# EasyEDA Pro project QV-601-Contril - 副本.eprj

# Schematic Schematic1

## Sheets
1 P1: Board Name: Schematic2; Create Date: 2025-07-12; Page Name: P1; Project Name: QV-601-Contril - 副本; Schematic Name: Schematic1; Update Date: 2025-07-28; Company: 嘉立创EDA; Page Size: A4; Version: V1.0
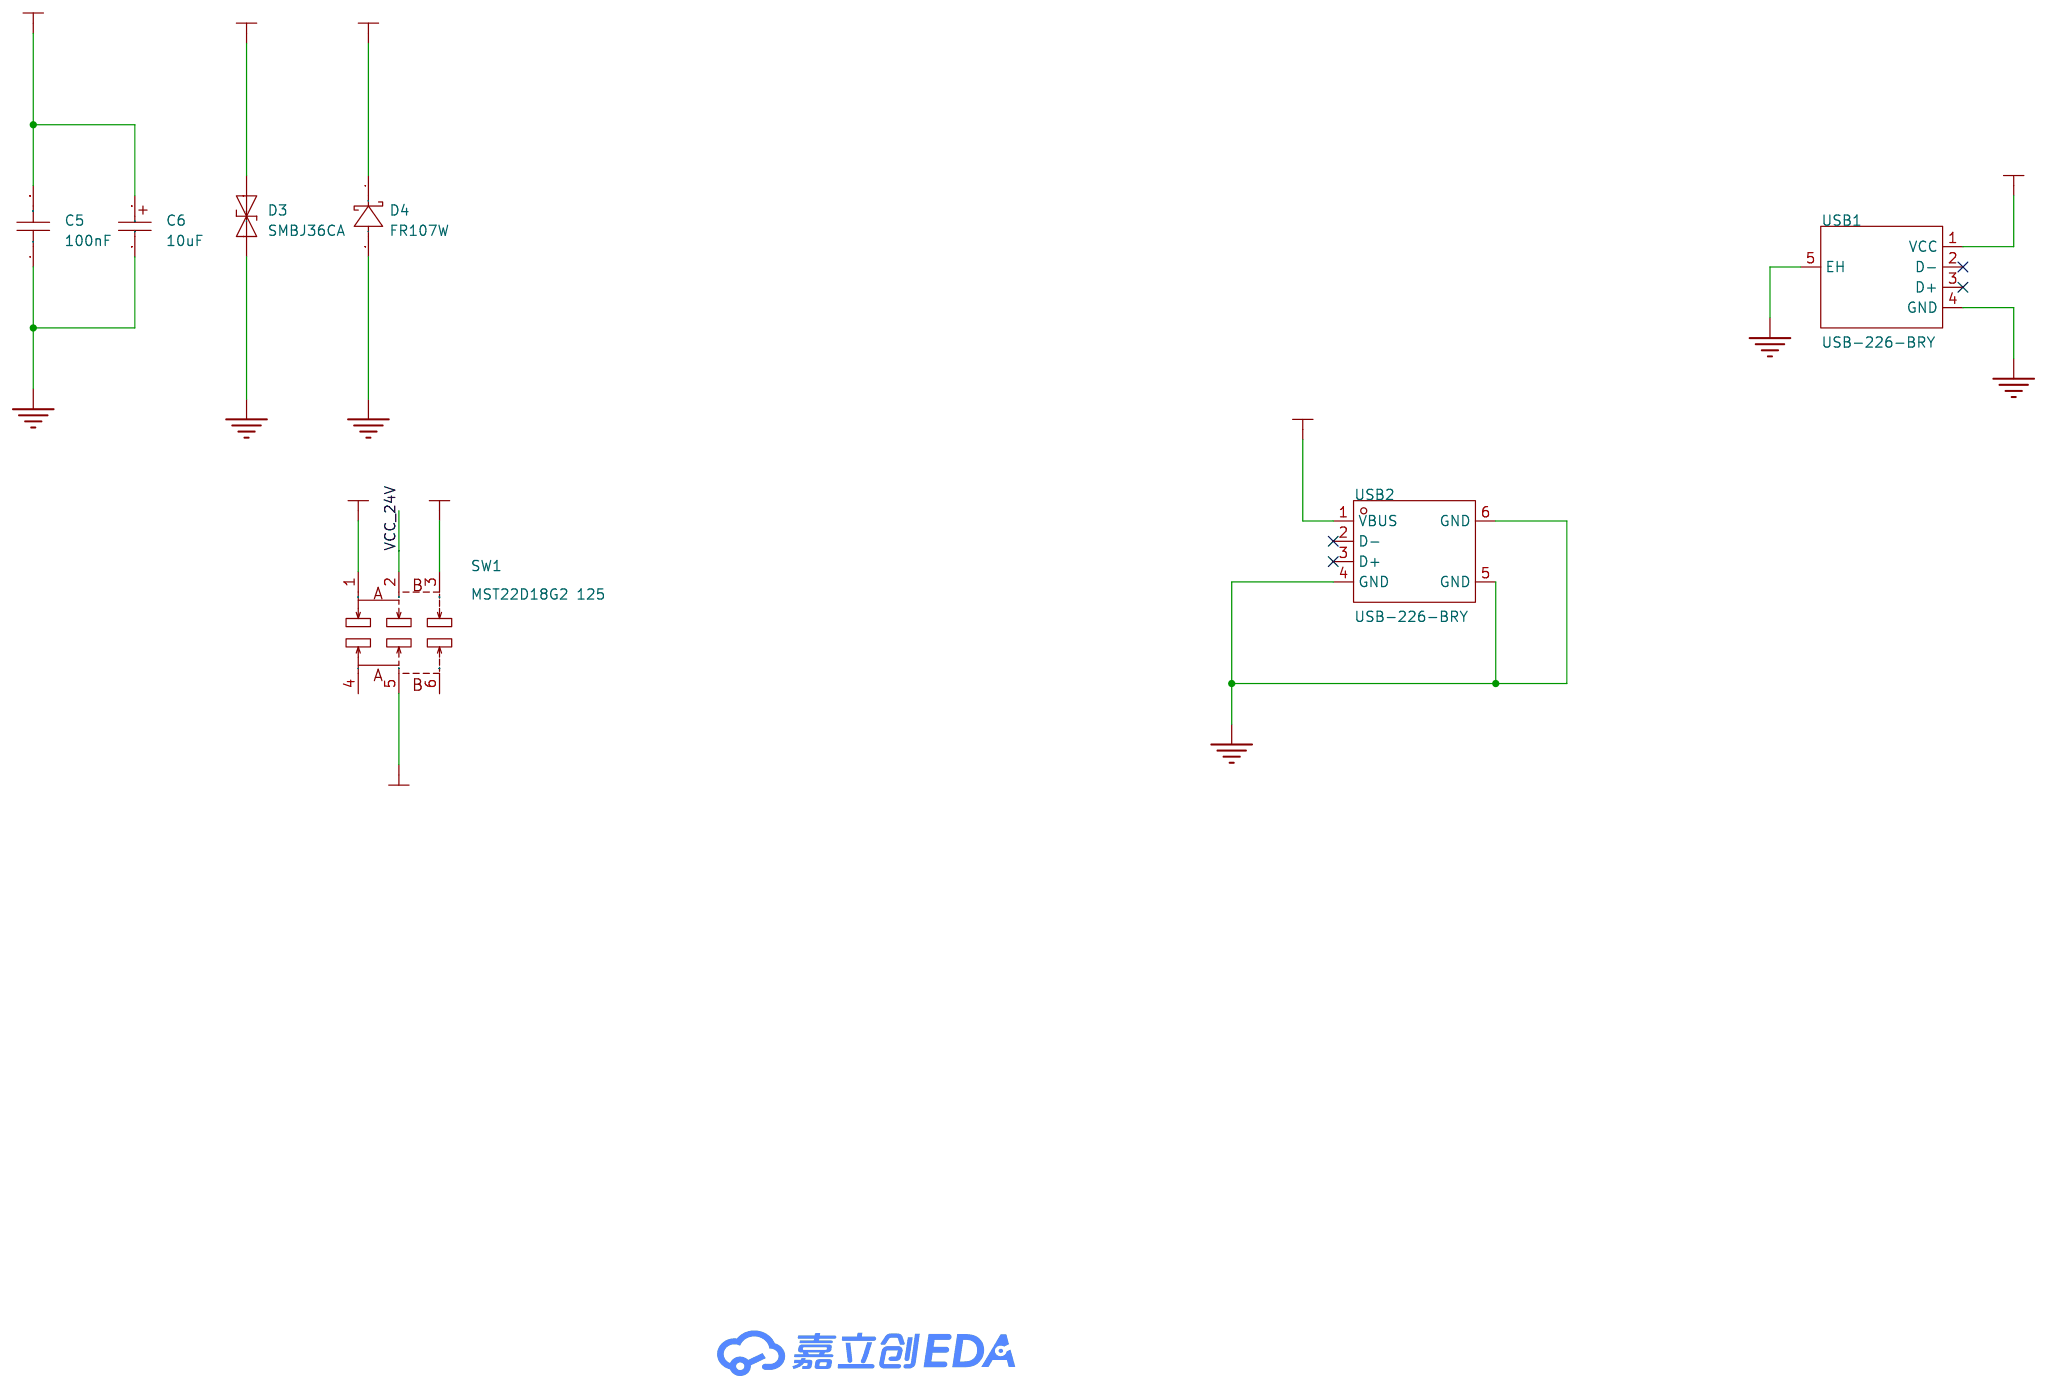
[diagram p0: P1]
2 P2: Create Date: 2025-07-28; Page Name: P2
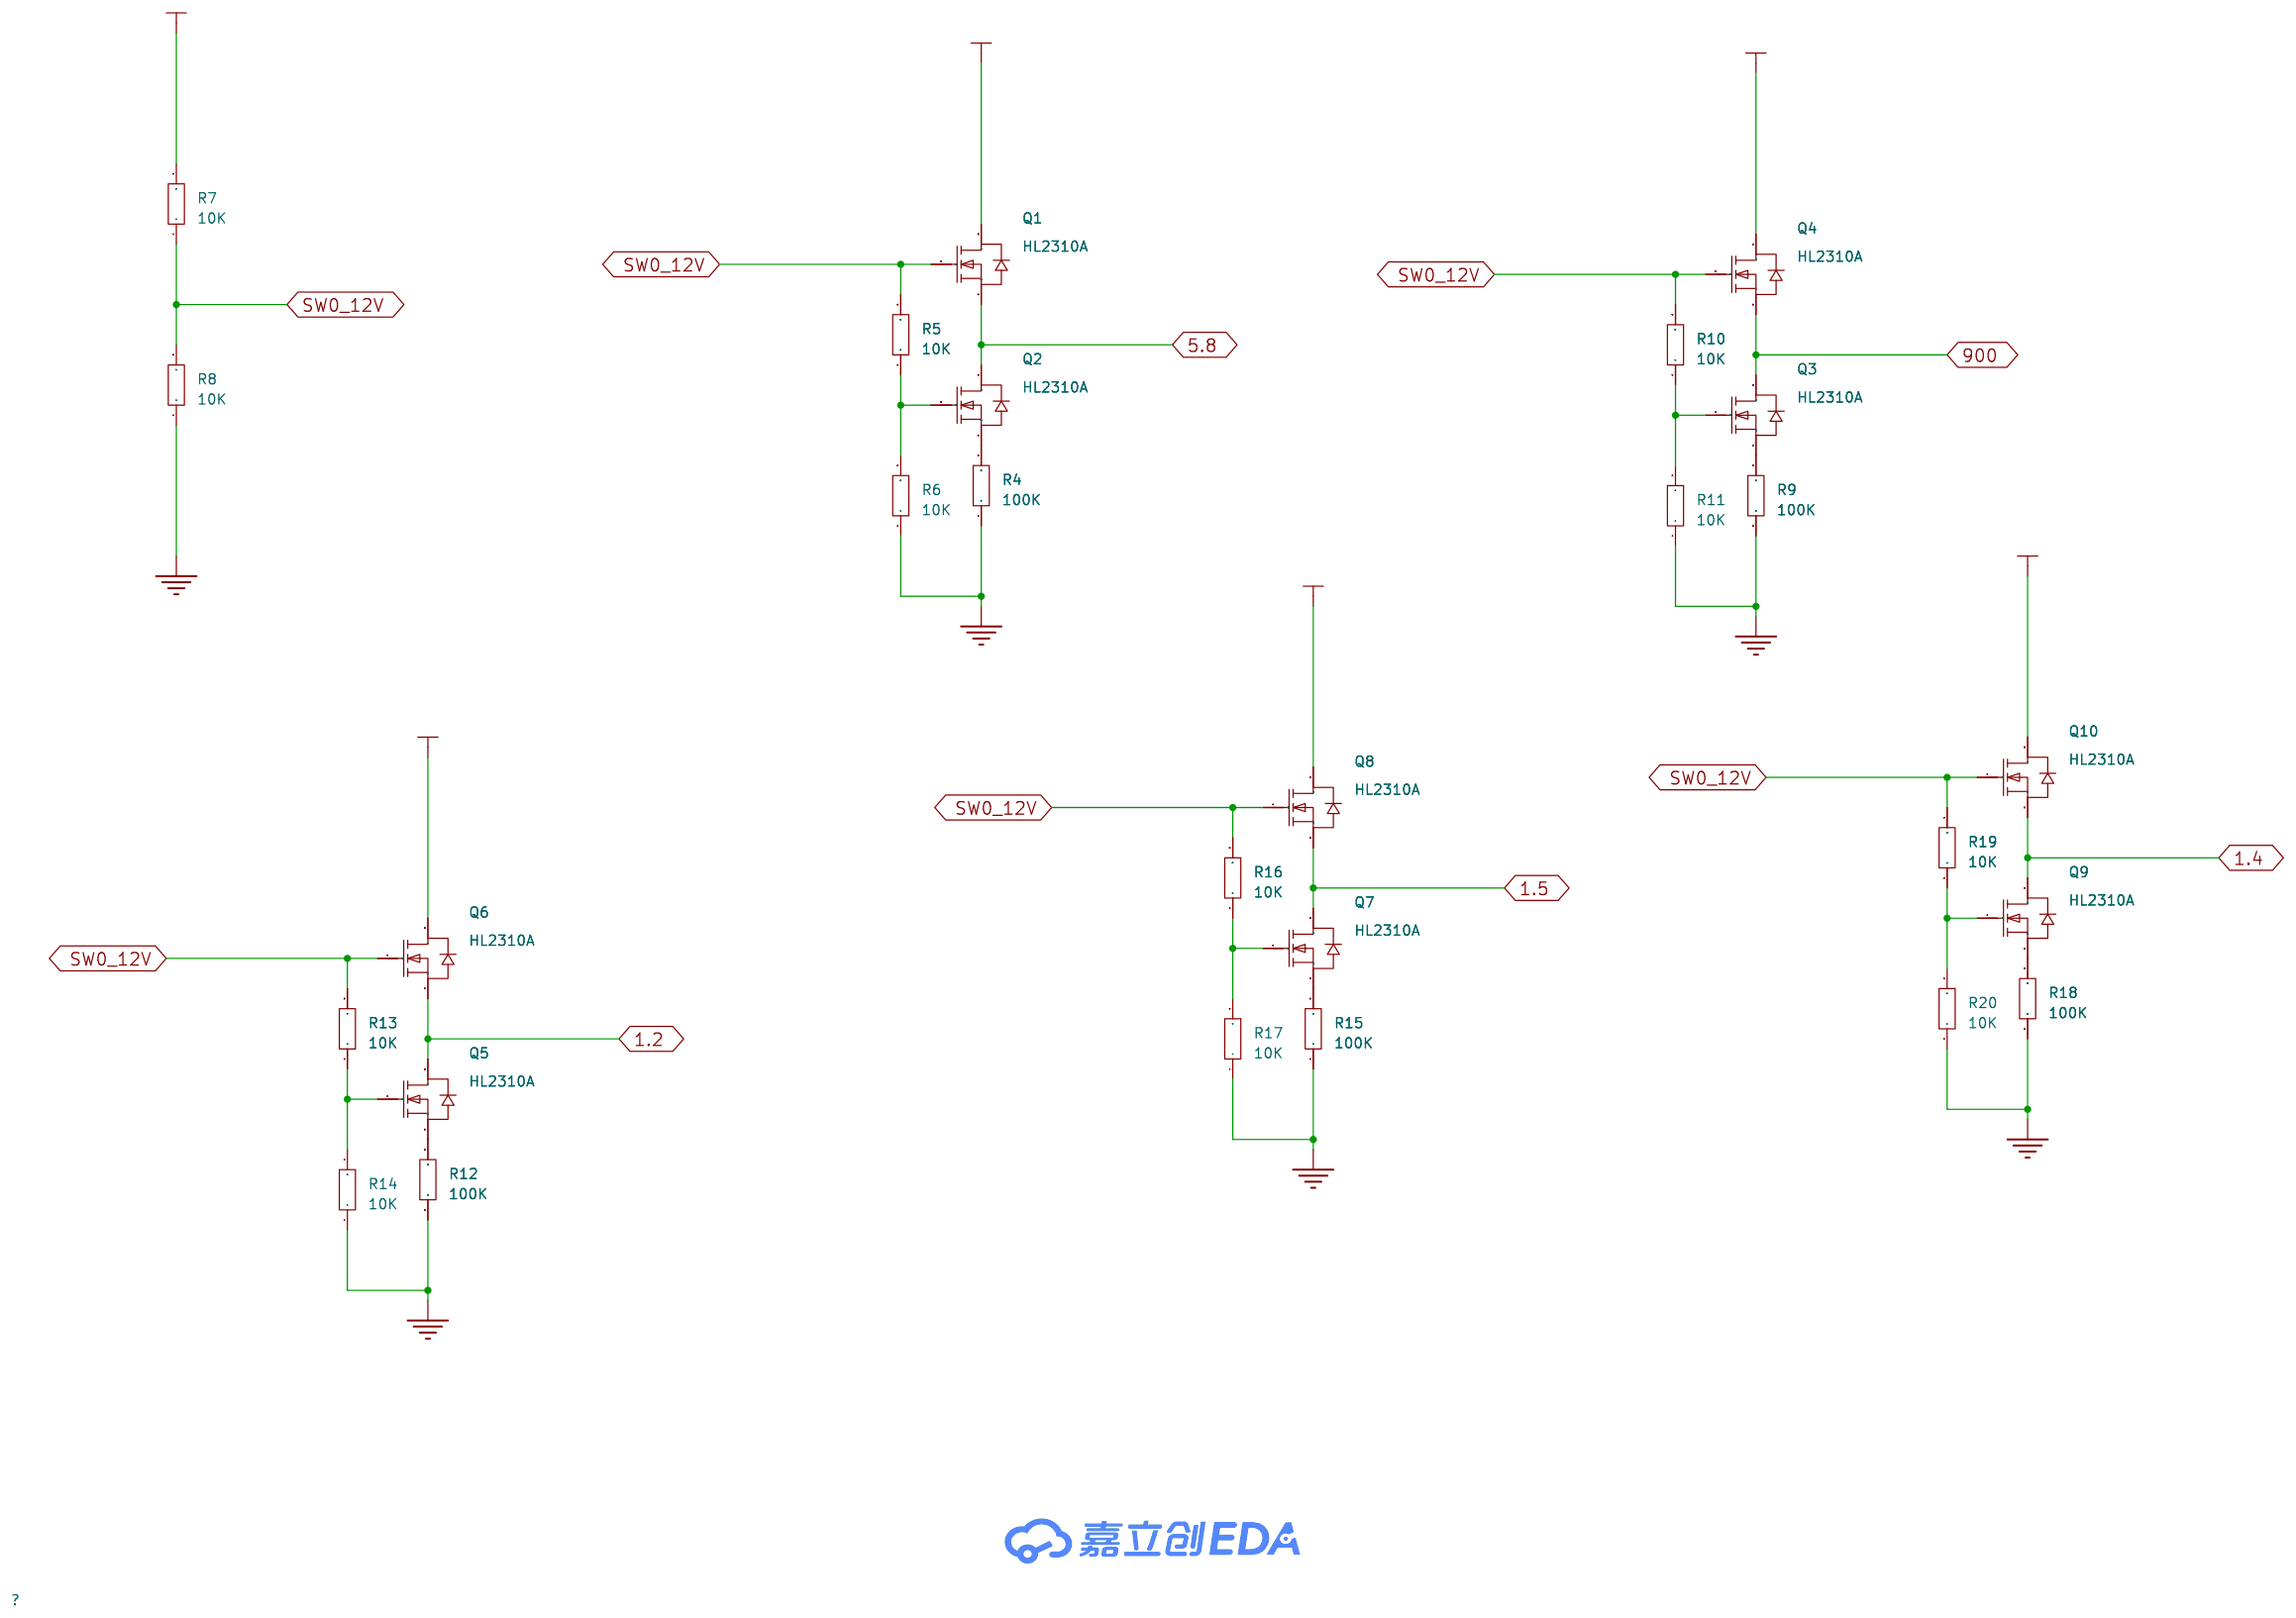
[diagram p1: P2]
3 P3: Create Date: 2025-07-28; Page Name: P3
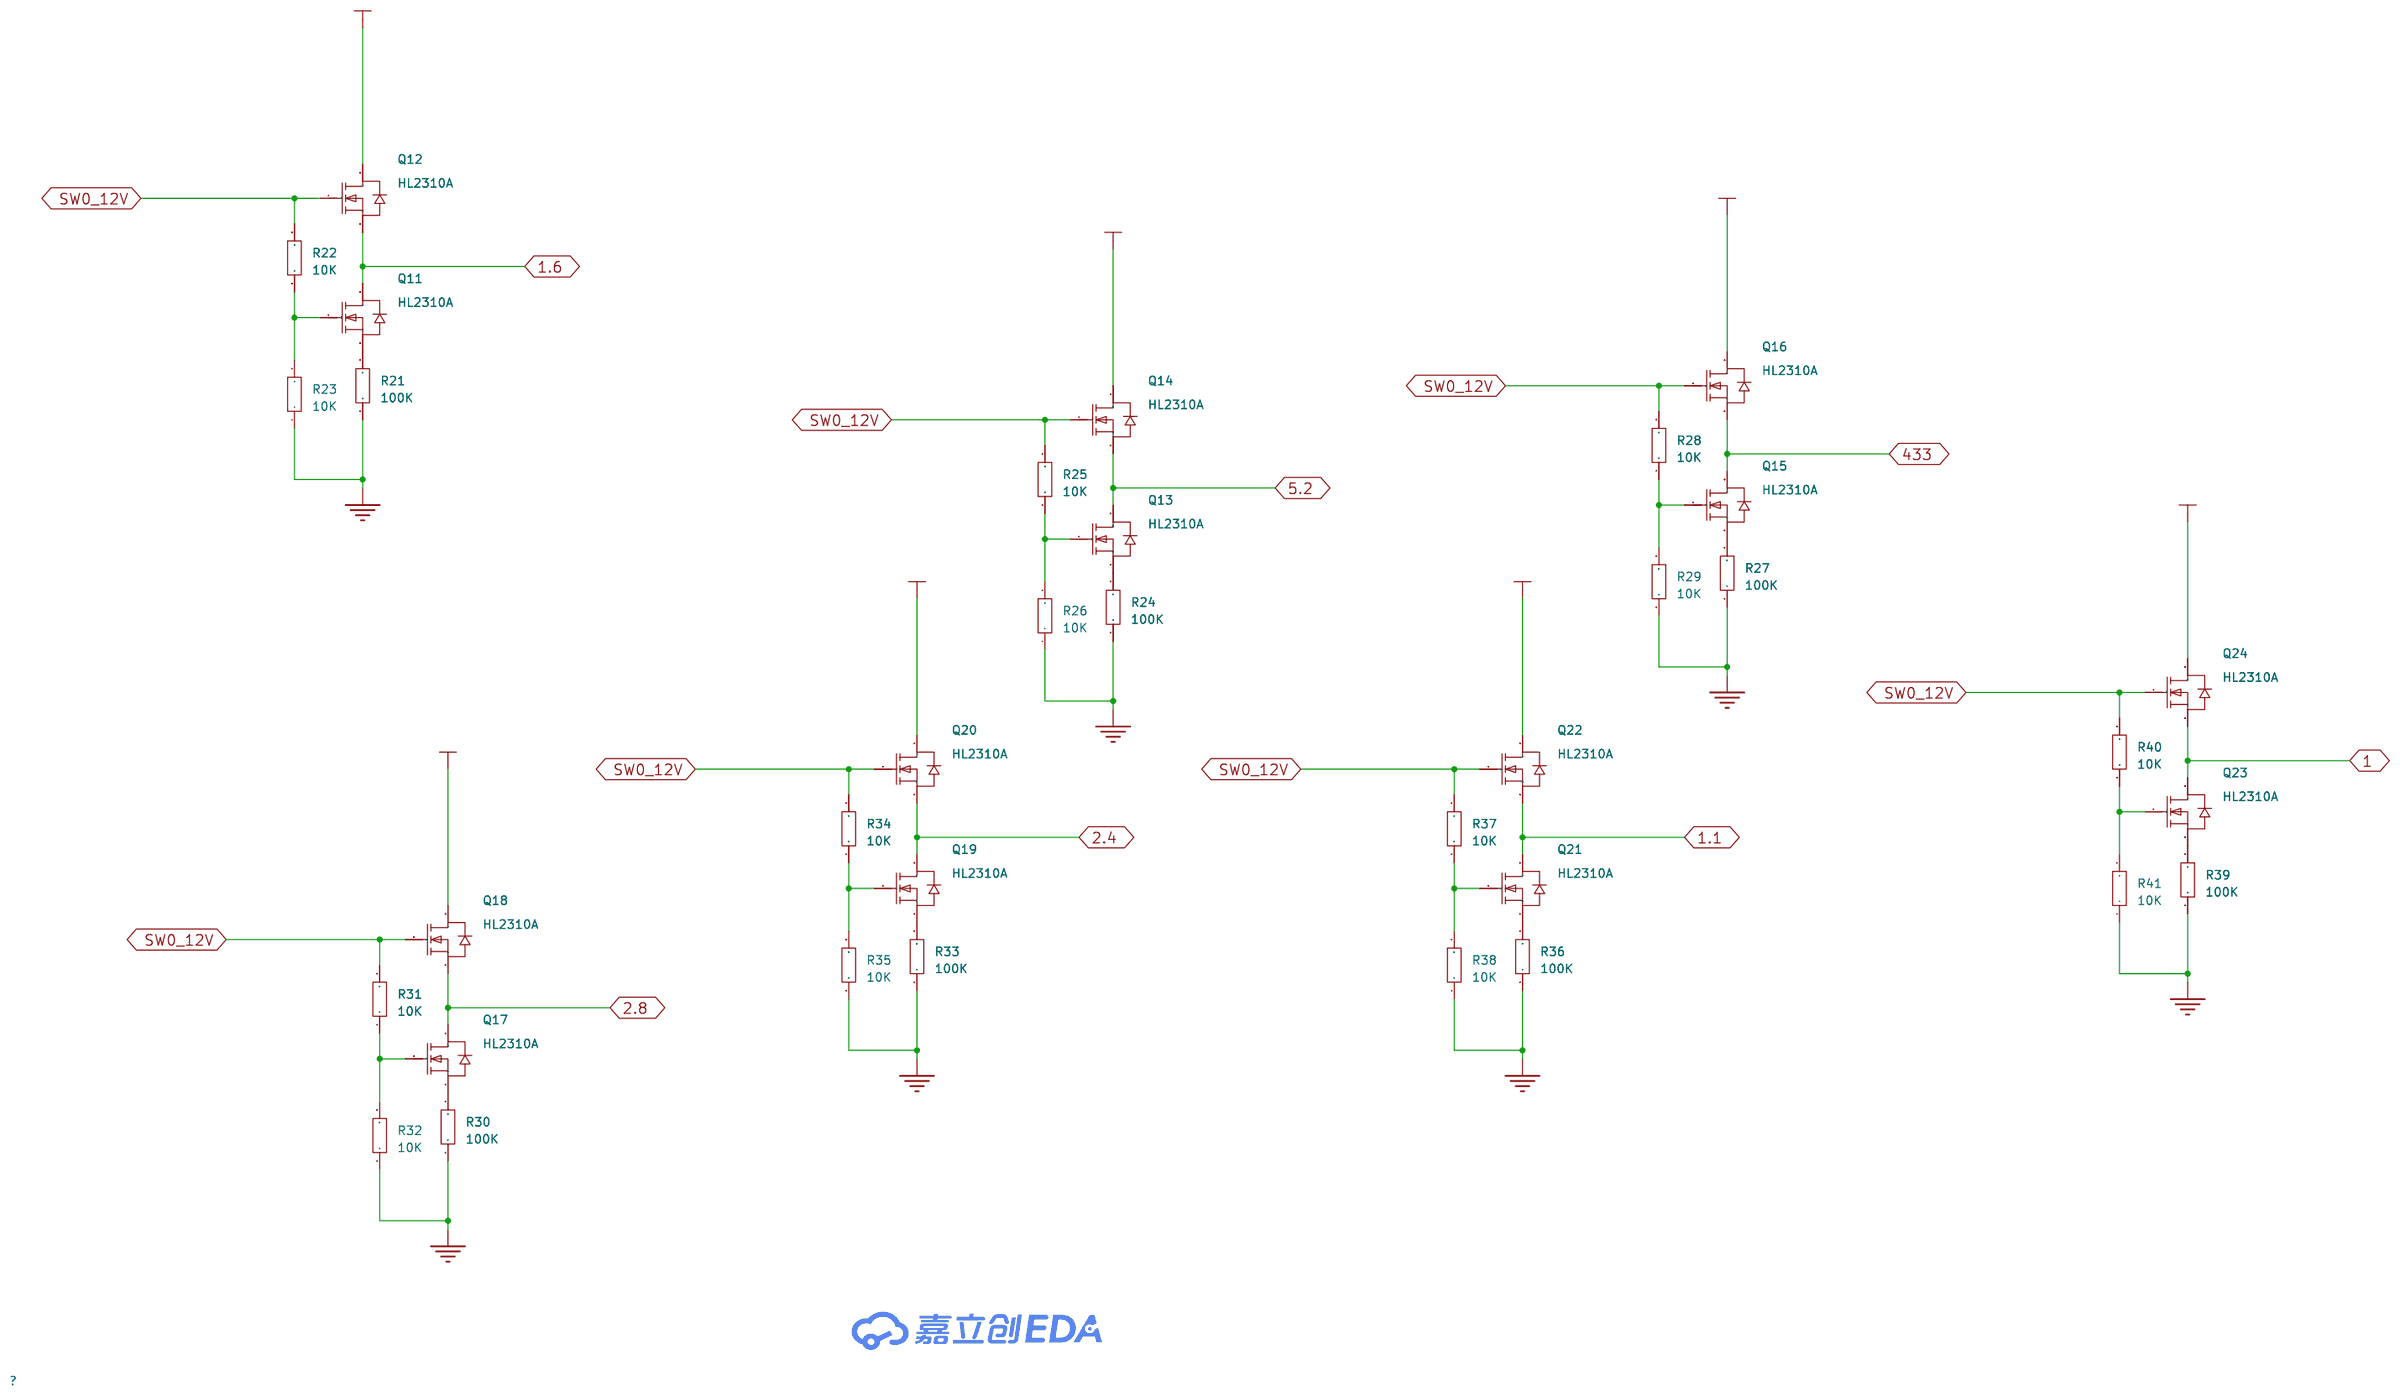
[diagram p2: P3]

## Parts
sheet P1
C5  100nF  [C0603]
C6  10uF  [C_Ele_SMD_3x5.4mm]
D3  SMBJ36CA  [SMB_L4.6-W3.6-LS5.3-BI]
D4  FR107W  [SOD-123FL_L2.7-W1.8-LS3.8-RD]
SW1  MST22D18G2 125  [SW-SMD_MST22D18G2]
USB1  USB-226-BRY  [USB-A-TH_USB-226-BRY]
USB2  USB-226-BRY  [USB-A_TH_USB-256-BRWH150]
sheet P2
Q1  HL2310A  [SOT-23-3_L2.9-W1.3-P1.90-LS2.4-BR]
Q2  HL2310A  [SOT-23-3_L2.9-W1.3-P1.90-LS2.4-BR]
Q3  HL2310A  [SOT-23-3_L2.9-W1.3-P1.90-LS2.4-BR]
Q4  HL2310A  [SOT-23-3_L2.9-W1.3-P1.90-LS2.4-BR]
Q5  HL2310A  [SOT-23-3_L2.9-W1.3-P1.90-LS2.4-BR]
Q6  HL2310A  [SOT-23-3_L2.9-W1.3-P1.90-LS2.4-BR]
Q7  HL2310A  [SOT-23-3_L2.9-W1.3-P1.90-LS2.4-BR]
Q8  HL2310A  [SOT-23-3_L2.9-W1.3-P1.90-LS2.4-BR]
Q9  HL2310A  [SOT-23-3_L2.9-W1.3-P1.90-LS2.4-BR]
Q10  HL2310A  [SOT-23-3_L2.9-W1.3-P1.90-LS2.4-BR]
R4  100K  [R0603]
R5  10K  [R0603]
R6  10K  [R0603]
R7  10K  [R0603]
R8  10K  [R0603]
R9  100K  [R0603]
R10  10K  [R0603]
R11  10K  [R0603]
R12  100K  [R0603]
R13  10K  [R0603]
R14  10K  [R0603]
R15  100K  [R0603]
R16  10K  [R0603]
R17  10K  [R0603]
R18  100K  [R0603]
R19  10K  [R0603]
R20  10K  [R0603]
sheet P3
Q11  HL2310A  [SOT-23-3_L2.9-W1.3-P1.90-LS2.4-BR]
Q12  HL2310A  [SOT-23-3_L2.9-W1.3-P1.90-LS2.4-BR]
Q13  HL2310A  [SOT-23-3_L2.9-W1.3-P1.90-LS2.4-BR]
Q14  HL2310A  [SOT-23-3_L2.9-W1.3-P1.90-LS2.4-BR]
Q15  HL2310A  [SOT-23-3_L2.9-W1.3-P1.90-LS2.4-BR]
Q16  HL2310A  [SOT-23-3_L2.9-W1.3-P1.90-LS2.4-BR]
Q17  HL2310A  [SOT-23-3_L2.9-W1.3-P1.90-LS2.4-BR]
Q18  HL2310A  [SOT-23-3_L2.9-W1.3-P1.90-LS2.4-BR]
Q19  HL2310A  [SOT-23-3_L2.9-W1.3-P1.90-LS2.4-BR]
Q20  HL2310A  [SOT-23-3_L2.9-W1.3-P1.90-LS2.4-BR]
Q21  HL2310A  [SOT-23-3_L2.9-W1.3-P1.90-LS2.4-BR]
Q22  HL2310A  [SOT-23-3_L2.9-W1.3-P1.90-LS2.4-BR]
Q23  HL2310A  [SOT-23-3_L2.9-W1.3-P1.90-LS2.4-BR]
Q24  HL2310A  [SOT-23-3_L2.9-W1.3-P1.90-LS2.4-BR]
R21  100K  [R0603]
R22  10K  [R0603]
R23  10K  [R0603]
R24  100K  [R0603]
R25  10K  [R0603]
R26  10K  [R0603]
R27  100K  [R0603]
R28  10K  [R0603]
R29  10K  [R0603]
R30  100K  [R0603]
R31  10K  [R0603]
R32  10K  [R0603]
R33  100K  [R0603]
R34  10K  [R0603]
R35  10K  [R0603]
R36  100K  [R0603]
R37  10K  [R0603]
R38  10K  [R0603]
R39  100K  [R0603]
R40  10K  [R0603]
R41  10K  [R0603]

## Library data of the parts
C5 = CAP_0603: Supplier Footprint: 0603
C6 = C_Ele_SMD_3x5.4mm: Supplier Footprint: SMD,3x5.4mm
D3 = SMBJ36CA_C83326: Supplier Part: C83326; Manufacturer: Littelfuse(美国力特); Supplier Footprint: SMB(DO-214AA); JLCPCB Part Class: 扩展库; Datasheet: https://atta.szlcsc.com/upload/public/pdf/source/20190807/C409416_D98C874D944FBE9BE31A2BD6B7A21533.pdf; Supplier: LCSC; polarity: 双向; Reverse Stand-Off Voltage (Vrwm): 36V; Maximum Clamping Voltage: 58.1V; Peak Pulse Current (Ipp): 10.4A; Peak Pulse Power Dissipation (Ppp): 600W; Breakdown Voltage: 40V; Type: TVS
D4 = FR107W_C18199114: Supplier Part: C18199114; Manufacturer: 宏嘉诚; Supplier Footprint: SOD-123FL; JLCPCB Part Class: 扩展库; Datasheet: https://atta.szlcsc.com/upload/public/pdf/source/20250116/CFD3D02D7202F2D6A6FEE7AEEDFF5E78.pdf; Supplier: LCSC; Diode Configuration: 独立式; Voltage - Forward(Vf@If): 1.3V@1.0A; Voltage - DC Reverse(Vr): 1kV; Current - Rectified: 1A; Reverse Leakage Current (Ir): 2uA@1000V; Reverse Recovery Time (trr): 500ns; Operating Temperature: -55℃~+150℃
SW1 = MST22D18G2 125: LCSC Part Name: 拨动开关/两档立式 6脚贴片 柄长2.0mm 大六立贴 9.1*3.5mm; Supplier Part: C2906280; Manufacturer: SHOU HAN(首韩); Supplier Footprint: SMD; JLCPCB Part Class: 扩展库; Datasheet: https://atta.szlcsc.com/upload/public/pdf/source/20211019/449AD4EDF23AADA7A5C4E3C063EDBB30.pdf; Supplier: LCSC; Circuit: 双刀双掷; Pin Style: 鸥翼型; Mounting Style: 立贴; Actuator Color: 黑色; Current Rating (DC): 100mA; Voltage Rating (DC): 12V; Mechanical Life: 1万次; Operating Temperature: -25℃~+70℃
USB1 = USB-226-BRY: LCSC Part Name: Type-A 母 侧插; Supplier Part: C720523; Manufacturer: XUNPU(讯普); Supplier Footprint: 插件; JLCPCB Part Class: 扩展库; Datasheet: https://atta.szlcsc.com/upload/public/pdf/source/20250304/9D0DDAB7BEF0F27DF71E5AD865AFBDD8.pdf; Supplier: LCSC; Connector Type: Type-A; Protocol Standard: USB 2.0; Gender: 母; Mounting Type: 侧插; Number of Contacts: 4P; Number of Ports: 1; Current Rating-Power: 1.5A; Operating Temperature: -20℃~+70℃
USB2 = USB-256-BRWH150: LCSC Part Name: Type-A 母 直插; Supplier Part: C720544; Manufacturer: XUNPU(讯普); Supplier Footprint: 插件; JLCPCB Part Class: 扩展库; Datasheet: https://atta.szlcsc.com/upload/public/pdf/source/20200812/C720544_3A01B35EF472B7FB04986893C594DBBE.pdf; Supplier: LCSC; Connector Type: Type-A; Standard: USB 2.0; Gender: 母; Number of Ports: 1; Number of Contacts: 4P; Mounting Style: 直插; Current Rating - Power (Max): 1.5A; Operating Temperature Range: -20℃~+70℃; Soldering Temperature(Max): 260℃
Q1-Q24 = HL2310A: 类型:1个N沟道;漏源电压(Vdss):60V;连续漏极电流(Id):3A;导通电阻(RDS(on)):105mΩ@10V,3A;耗散功率(Pd):1.2W;阈值电压(Vgs(th)):900mV;; LCSC Part Name: 1个N沟道 耐压:60V 电流:3A; Supplier Part: C7420347; Manufacturer: 宏嘉诚; Supplier Footprint: SOT-23; JLCPCB Part Class: 扩展库; Datasheet: https://atta.szlcsc.com/upload/public/pdf/source/20250106/0767C2FB84E4D4EE17C25A82C2CC6974.pdf; Supplier: LCSC; Type: 1个N沟道; Drain to Source Voltage: 60V; Current - Continuous Drain(Id): 3A; RDS(on): 105mΩ@10V,3A; Pd - Power Dissipation: 1.2W; Gate Threshold Voltage (Vgs(th)@Id): 900mV; Input Capacitance(Ciss@Vds): 247pF; Reverse Transfer Capacitance (Crss@Vds): 19.5pF; Operating Temperature: -55℃~+150℃
R4-R41 = Res_0603: Supplier Footprint: 0603

## Nets
GND: C5.1 C6.2 D3.1(K) D4.2(A) R4.1 R6.1 R8.1 R9.1 R11.1 R12.1 R14.1 R15.1 R17.1 R18.1 R20.1 R21.1 R23.1 R24.1 R26.1 R27.1 R29.1 R30.1 R32.1 R33.1 R35.1 R36.1 R38.1 R39.1 R41.1 USB1.4(GND) USB1.5(EH) USB2.4(GND) USB2.5(GND) USB2.6(GND)
VCC_5V: USB1.1(VCC) USB2.1(VBUS)
VCC_24V: D3.2(A) D4.1(K) Q1.3(D) Q4.3(D) Q6.3(D) Q8.3(D) Q10.3(D) Q12.3(D) Q14.3(D) Q16.3(D) Q18.3(D) Q20.3(D) Q22.3(D) Q24.3(D) SW1.2 SW1.5
VCC_24V_OUT: SW1.1
1: Q23.3(D) Q24.2(S)
1.1: Q21.3(D) Q22.2(S)
1.2: Q5.3(D) Q6.2(S)
1.4: Q9.3(D) Q10.2(S)
1.5: Q7.3(D) Q8.2(S)
1.6: Q11.3(D) Q12.2(S)
2.4: Q19.3(D) Q20.2(S)
2.8: Q17.3(D) Q18.2(S)
5.2: Q13.3(D) Q14.2(S)
5.8: Q1.2(S) Q2.3(D)
433: Q15.3(D) Q16.2(S)
900: Q3.3(D) Q4.2(S)
SW0: R7.2
SW0_12V: Q1.1(G) Q4.1(G) Q6.1(G) Q8.1(G) Q10.1(G) Q12.1(G) Q14.1(G) Q16.1(G) Q18.1(G) Q20.1(G) Q22.1(G) Q24.1(G) R5.2 R7.1 R8.2 R10.2 R13.2 R16.2 R19.2 R22.2 R25.2 R28.2 R31.2 R34.2 R37.2 R40.2
V+: C5.2 C6.1 SW1.3
$2N560: Q2.2(S) R4.2
$2N659: Q2.1(G) R5.1 R6.2
$2N1166: Q3.1(G) R10.1 R11.2
$2N1170: Q3.2(S) R9.2
$2N1394: Q5.1(G) R13.1 R14.2
$2N1398: Q5.2(S) R12.2
$2N1622: Q7.1(G) R16.1 R17.2
$2N1626: Q7.2(S) R15.2
$2N1850: Q9.1(G) R19.1 R20.2
$2N2502: Q9.2(S) R18.2
$3N270: Q11.1(G) R22.1 R23.2
$3N274: Q11.2(S) R21.2
$3N498: Q13.1(G) R25.1 R26.2
$3N502: Q13.2(S) R24.2
$3N726: Q15.1(G) R28.1 R29.2
$3N730: Q15.2(S) R27.2
$3N954: Q17.1(G) R31.1 R32.2
$3N958: Q17.2(S) R30.2
$3N1182: Q19.1(G) R34.1 R35.2
$3N1186: Q19.2(S) R33.2
$3N1410: Q21.1(G) R37.1 R38.2
$3N1414: Q21.2(S) R36.2
$3N1641: Q23.1(G) R40.1 R41.2
$3N1645: Q23.2(S) R39.2

Not connected (* = marked no-connect by the designer): SW1 4 6; USB1 2(D-)* 3(D+)*; USB2 2(D-)* 3(D+)*

# Board QV-601-Contril
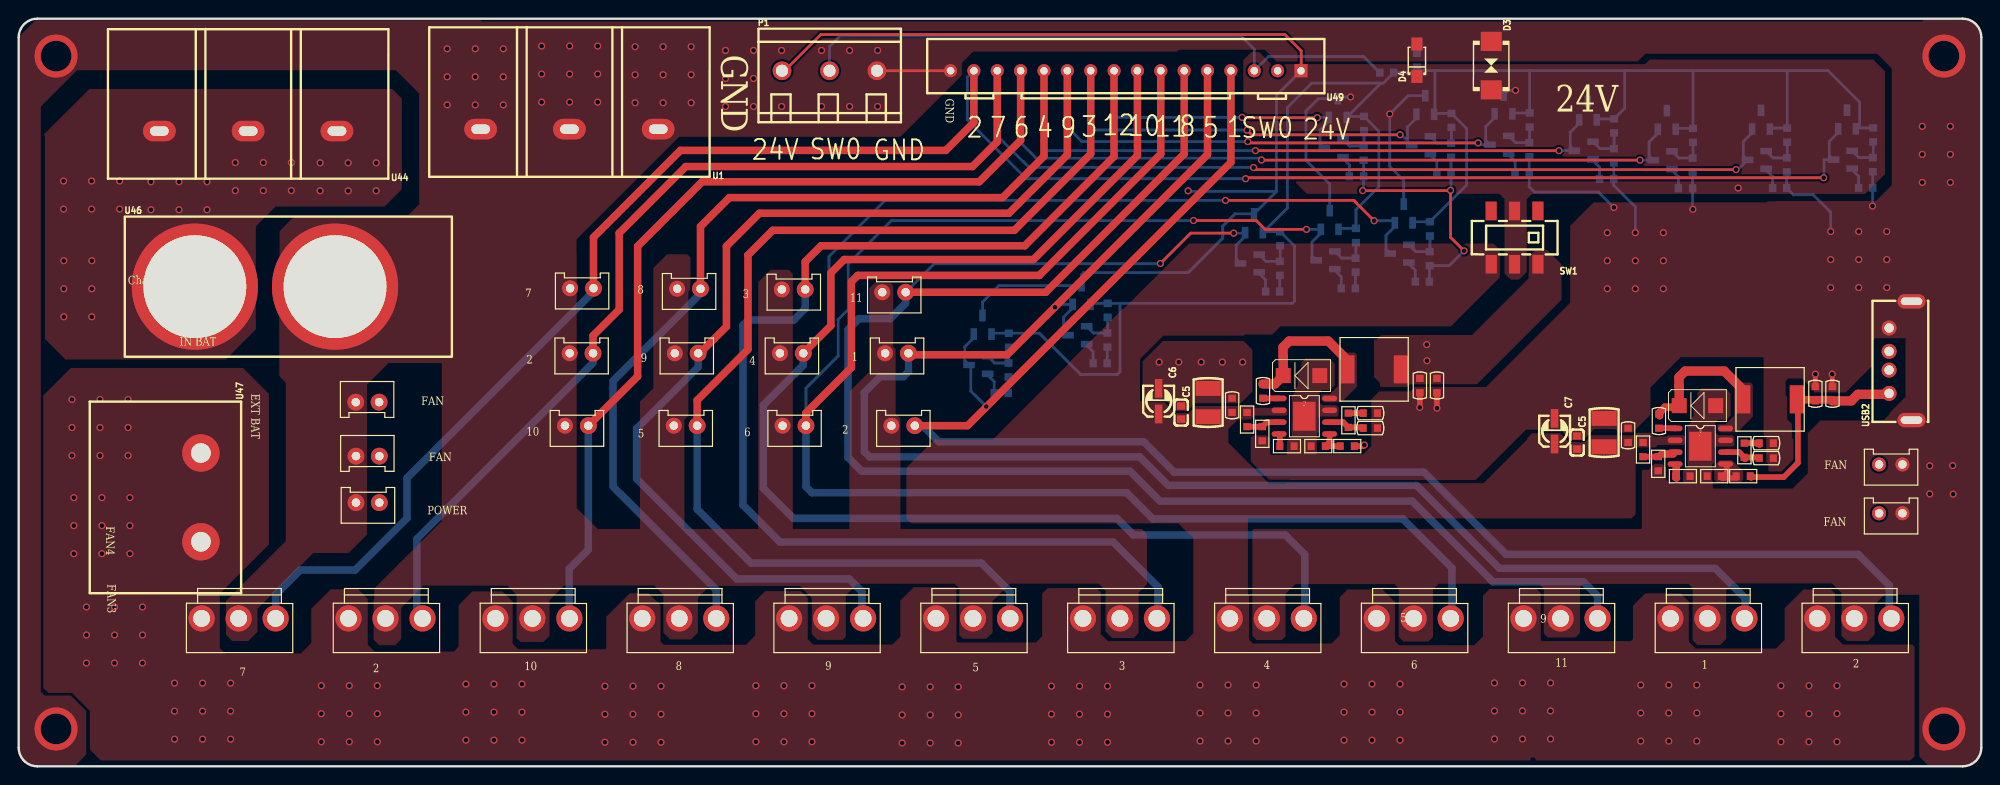
[diagram p3: board, top side]
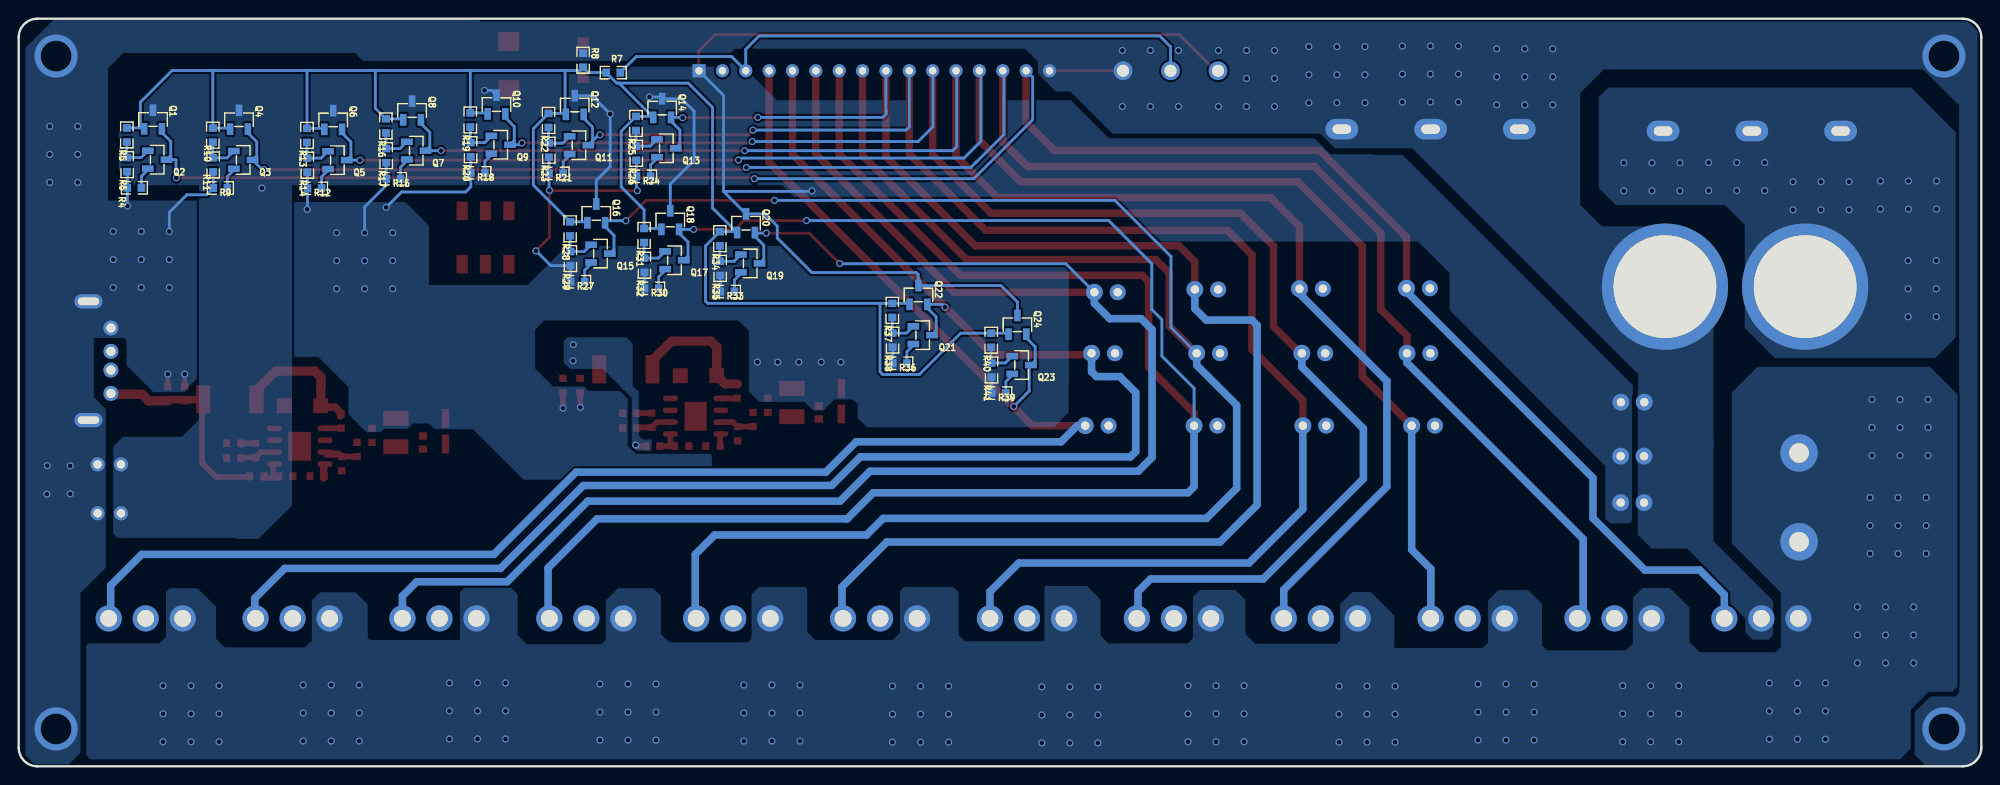
[diagram p4: board, bottom side, seen from below]

Outline 210 x 80 mm; copper layers: Top Layer, Bottom Layer. Coordinates in mm from the lower left corner of the outline.
Outline path: 0,78 0,2 arc(0.59,0.59) 2,0 208,0 arc(209.41,0.59) 210,2 210,78 arc(209.41,79.41) 208,80 2,80 arc(0.59,79.41) 0,78
Stack: Top Layer 0.035mm / Dielectric1 1.51mm FR4 er 4.5 / Bottom Layer 0.035mm

## Design rules (mm)
net J1: Top Side Components
net L4: Top Side Components
net R40: Top Side Components
net R38: Top Side Components
net R37: Top Side Components
net R39: Top Side Components
net R36: Top Side Components
net R35: Top Side Components
net D1: Top Side Components
net C56: Top Side Components
net C52: Top Side Components
net C57: Top Side Components
net C54: Top Side Components
net C53: Top Side Components
net C59: Top Side Components
net C58: Top Side Components
net U41: Top Side Components
net U40: Top Side Components
net J9: Top Side Components
net J8: Top Side Components
net J7: Top Side Components
net J6: Top Side Components
net J5: Top Side Components
net J4: Top Side Components
net J3: Top Side Components
net J15: Top Side Components
net J14: Top Side Components
net J13: Top Side Components
net J12: Top Side Components
net J11: Top Side Components
net J10: Top Side Components
net U9: Top Side Components
net U8: Top Side Components
net U7: Top Side Components
net U6: Top Side Components
net U5: Top Side Components
net U12: Top Side Components
net U11: Top Side Components
net U10: Top Side Components
net U2: Top Side Components
net U3: Top Side Components
net U1: Top Side Components
net J2: Top Side Components
net U4: Top Side Components
template: 用户自定义配置
spacing Clearance (default): track to track 0.254, other pairs 0 to 0.254
track width Width (default): min 0.3, default 1, max 2
differential pair DiffPairsRouting (default): width min 0.381, default 0.381, max 0.381; gap min 0.254, default 0.254
via RoutingVias (default): diameter min 0.61, default 0.762, max 4.6; hole min 0.305, default 0.508, max 3.3

## Placement (name value [footprint] x y rotation side)
C1  CAP NP_C0603_10UF/10V  [C0603#2]  149.93 40.75 270 top
C2  CAP NP_C0603_10UF/10V  [C0603#2]  151.76 40.75 270 top
C3  CAP NP_C1210_10UF/50V  [C1210]  127.27 38.93 90 top
C4  CAP NP_C0603_100NF  [C0603#2]  129.84 38.63 90 top
C5  100nF  [C0603]  124.38 37.85 270 top
C5#2  -  [C0603]  166.75 34.64 270 top
C6  10uF  [C_Ele_SMD_3x5.4mm]  121.98 39.07 270 top
C7  10uF  [C_Ele_SMD_3x5.4mm]  164.35 35.86 270 top
C8  CAP NP_C0603_100NF  [C0603#2]  133.14 40.15 90 top
C10  CAP NP_C0603_100NF  [C0603#2]  144.62 37.79 180 top
C11  CAP NP_C0603_100NF  [C0603#2]  144.62 36.19 180 top
C52  CAP NP_C0603_100NF  [C0603#2]  175.51 36.94 90 top
C53  CAP NP_C0603_10UF/10V  [C0603#2]  194.07 39.86 90 top
C54  CAP NP_C0603_10UF/10V  [C0603#2]  192.24 39.86 90 top
C56  CAP NP_C1210_10UF/50V  [C1210]  169.64 35.72 90 top
C57  CAP NP_C0603_100NF  [C0603#2]  172.2 35.42 90 top
C58  CAP NP_C0603_100NF  [C0603#2]  186.99 32.98 180 top
C59  CAP NP_C0603_100NF  [C0603#2]  186.99 34.58 180 top
D1  SS54_SMA_SS34  [SMA]  179.63 38.59 180 top
D2  SS54_SMA_SS34  [SMA]  137.26 41.81 180 top
D3  SMBJ36CA  [SMB_L4.6-W3.6-LS5.3-BI]  157.56 74.98 270 top
D4  FR107W  [SOD-123FL_L2.7-W1.8-LS3.8-RD]  149.61 75.55 90 top
J1  CON2_XH2R54-21_ZX-XH2.54-2PZZ  [XH2R54-21]  70.09 36.45 0 top
J2  CON2_XH2R54-21_ZX-XH2.54-2PZZ  [XH2R54-21]  92.7 44.2 0 top
J3  CON2_XH2R54-21_ZX-XH2.54-2PZZ  [XH2R54-21#2]  38.56 38.96 180 top
J4  CON2_XH2R54-21_ZX-XH2.54-2PZZ  [XH2R54-21#3]  199.06 27.08 0 top
J5  CON2_XH2R54-21_ZX-XH2.54-2PZZ  [XH2R54-21#3]  199.06 32.3 0 top
J6  CON2_XH2R54-21_ZX-XH2.54-2PZZ  [XH2R54-21]  59 51.15 0 top
J7  CON2_XH2R54-21_ZX-XH2.54-2PZZ  [XH2R54-21]  58.95 44.2 0 top
J8  CON2_XH2R54-21_ZX-XH2.54-2PZZ  [XH2R54-21]  58.45 36.45 0 top
J9  CON2_XH2R54-21_ZX-XH2.54-2PZZ  [XH2R54-21]  70.45 51.1 0 top
J10  CON2_XH2R54-21_ZX-XH2.54-2PZZ  [XH2R54-21]  70.2 44.2 0 top
J11  CON2_XH2R54-21_ZX-XH2.54-2PZZ  [XH2R54-21#2]  36.09 28.21 0 top
J12  CON2_XH2R54-21_ZX-XH2.54-2PZZ  [XH2R54-21]  81.65 51.03 0 top
J13  CON2_XH2R54-21_ZX-XH2.54-2PZZ  [XH2R54-21]  81.45 44.2 0 top
J14  CON2_XH2R54-21_ZX-XH2.54-2PZZ  [XH2R54-21]  93.38 36.45 0 top
J15  CON2_XH2R54-21_ZX-XH2.54-2PZZ  [XH2R54-21#2]  38.59 33.19 180 top
J16  CON2_XH2R54-21_ZX-XH2.54-2PZZ  [XH2R54-21]  81.74 36.45 0 top
J17  CON2_XH2R54-21_ZX-XH2.54-2PZZ  [XH2R54-21]  92.4 50.73 0 top
L1  JLSHC0630_3R3M_L0650_CYA0650-22  [L0650]  142.18 42.48 90 top
L4  JLSHC0630_3R3M_L0650_CYA0650-22  [L0650]  184.55 39.27 90 top
P1  WJ500V-5.08-3P  [CONN-TH_3P-P5.00_WJ500V-5.08-3P]  86.75 74.43 0 top
Q1  HL2310A  [SOT-23-3_L2.9-W1.3-P1.90-LS2.4-BR]  195.63 69.21 270 bottom
Q2  HL2310A  [SOT-23-3_L2.9-W1.3-P1.90-LS2.4-BR]  195.18 64.91 0 bottom
Q3  HL2310A  [SOT-23-3_L2.9-W1.3-P1.90-LS2.4-BR]  185.98 64.89 0 bottom
Q4  HL2310A  [SOT-23-3_L2.9-W1.3-P1.90-LS2.4-BR]  186.43 69.19 270 bottom
Q5  HL2310A  [SOT-23-3_L2.9-W1.3-P1.90-LS2.4-BR]  175.9 64.86 0 bottom
Q6  HL2310A  [SOT-23-3_L2.9-W1.3-P1.90-LS2.4-BR]  176.35 69.16 270 bottom
Q7  HL2310A  [SOT-23-3_L2.9-W1.3-P1.90-LS2.4-BR]  167.46 65.88 0 bottom
Q8  HL2310A  [SOT-23-3_L2.9-W1.3-P1.90-LS2.4-BR]  167.91 70.18 270 bottom
Q9  HL2310A  [SOT-23-3_L2.9-W1.3-P1.90-LS2.4-BR]  158.43 66.51 0 bottom
Q10  HL2310A  [SOT-23-3_L2.9-W1.3-P1.90-LS2.4-BR]  158.88 70.81 270 bottom
Q11  HL2310A  [SOT-23-3_L2.9-W1.3-P1.90-LS2.4-BR]  150.05 66.46 0 bottom
Q12  HL2310A  [SOT-23-3_L2.9-W1.3-P1.90-LS2.4-BR]  150.5 70.76 270 bottom
Q13  HL2310A  [SOT-23-3_L2.9-W1.3-P1.90-LS2.4-BR]  140.7 66.14 0 bottom
Q14  HL2310A  [SOT-23-3_L2.9-W1.3-P1.90-LS2.4-BR]  141.15 70.44 270 bottom
Q15  HL2310A  [SOT-23-3_L2.9-W1.3-P1.90-LS2.4-BR]  147.75 54.86 0 bottom
Q16  HL2310A  [SOT-23-3_L2.9-W1.3-P1.90-LS2.4-BR]  148.2 59.16 270 bottom
Q17  HL2310A  [SOT-23-3_L2.9-W1.3-P1.90-LS2.4-BR]  139.83 54.15 0 bottom
Q18  HL2310A  [SOT-23-3_L2.9-W1.3-P1.90-LS2.4-BR]  140.28 58.45 270 bottom
Q19  HL2310A  [SOT-23-3_L2.9-W1.3-P1.90-LS2.4-BR]  131.73 53.81 0 bottom
Q20  HL2310A  [SOT-23-3_L2.9-W1.3-P1.90-LS2.4-BR]  132.18 58.11 270 bottom
Q21  HL2310A  [SOT-23-3_L2.9-W1.3-P1.90-LS2.4-BR]  113.27 46.14 0 bottom
Q22  HL2310A  [SOT-23-3_L2.9-W1.3-P1.90-LS2.4-BR]  113.72 50.44 270 bottom
Q23  HL2310A  [SOT-23-3_L2.9-W1.3-P1.90-LS2.4-BR]  102.69 42.94 0 bottom
Q24  HL2310A  [SOT-23-3_L2.9-W1.3-P1.90-LS2.4-BR]  103.14 47.24 270 bottom
R1  R2_R0603_51K  [R0603]  131.44 37.11 90 top
R2  R2_R0603_8K  [R0603]  133.06 35.58 90 top
R3  R2_R0603_10K  [R0603]  142.28 37.03 270 top
R4  100K  [R0603]  135.7 34.26 180 top
R4#2  -  [R0603#2]  197.62 61.91 180 bottom
R5  10K  [R0603]  139.06 34.26 0 top
R5#2  -  [R0603#2]  198.43 67.56 90 bottom
R6  10K  [R0603]  142.16 34.26 0 top
R6#2  -  [R0603#2]  198.4 64.38 90 bottom
R7  10K  [R0603#2]  146.38 74.23 180 bottom
R8  10K  [R0603#2]  149.61 75.55 270 bottom
R9  100K  [R0603#2]  188.42 61.88 180 bottom
R10  10K  [R0603#2]  189.23 67.54 90 bottom
R11  10K  [R0603#2]  189.2 64.36 90 bottom
R12  100K  [R0603#2]  178.35 61.86 180 bottom
R13  10K  [R0603#2]  179.15 67.51 90 bottom
R14  10K  [R0603#2]  179.12 64.33 90 bottom
R15  100K  [R0603#2]  169.9 62.87 180 bottom
R16  10K  [R0603#2]  170.71 68.53 90 bottom
R17  10K  [R0603#2]  170.68 65.35 90 bottom
R18  100K  [R0603#2]  160.87 63.51 180 bottom
R19  10K  [R0603#2]  161.68 69.16 90 bottom
R20  10K  [R0603#2]  161.64 65.98 90 bottom
R21  100K  [R0603#2]  152.49 63.46 180 bottom
R22  10K  [R0603#2]  153.3 69.11 90 bottom
R23  10K  [R0603#2]  153.27 65.93 90 bottom
R24  100K  [R0603#2]  143.14 63.13 180 bottom
R25  10K  [R0603#2]  143.95 68.79 90 bottom
R26  10K  [R0603#2]  143.92 65.61 90 bottom
R27  100K  [R0603#2]  150.19 51.86 180 bottom
R28  10K  [R0603#2]  151 57.51 90 bottom
R29  10K  [R0603#2]  150.97 54.33 90 bottom
R30  100K  [R0603#2]  142.28 51.15 180 bottom
R31  10K  [R0603#2]  143.08 56.8 90 bottom
R32  10K  [R0603#2]  143.05 53.62 90 bottom
R33  100K  [R0603#2]  134.17 50.81 180 bottom
R34  10K  [R0603#2]  134.98 56.46 90 bottom
R35  10K  [R0603]  184.52 31.05 0 top
R35#2  -  [R0603#2]  134.94 53.28 90 bottom
R36  100K  [R0603]  181.42 31.05 0 top
R36#2  -  [R0603#2]  115.72 43.13 180 bottom
R37  10K  [R0603]  173.8 33.9 90 top
R37#2  -  [R0603#2]  116.52 48.79 90 bottom
R38  10K  [R0603]  184.65 33.82 270 top
R38#2  -  [R0603#2]  116.49 45.61 90 bottom
R39  100K  [R0603]  175.43 32.37 90 top
R39#2  -  [R0603#2]  105.13 39.94 180 bottom
R40  10K  [R0603]  178.07 31.05 180 top
R40#2  -  [R0603#2]  105.94 45.59 90 bottom
R41  10K  [R0603#2]  105.91 42.41 90 bottom
SW1  MST22D18G2 125  [SW-SMD_MST22D18G2]  160.06 56.58 180 top
U1  DBT50G-9.5-3P-BK-P OGC  [CONN-TH_3P-P9.50_DBT50G-9.5-3P]  58.93 68.18 180 top
U2  TPS54360BDDAR_SOIC8E_TPS54360BD  [SOIC8E]  137.57 37.46 270 top
U3  CON3_VH3R96-3P1_VH3.96-3P ZZ  [VH3R96-3P1]  149.26 15.83 0 top
U4  CON3_VH3R96-3P1_VH3.96-3P ZZ  [VH3R96-3P1]  164.98 15.83 0 top
U5  CON3_VH3R96-3P1_VH3.96-3P ZZ  [VH3R96-3P1]  133.55 15.83 0 top
U6  CON3_VH3R96-3P1_VH3.96-3P ZZ  [VH3R96-3P1]  23.53 15.83 0 top
U7  CON3_VH3R96-3P1_VH3.96-3P ZZ  [VH3R96-3P1]  39.25 15.83 0 top
U8  CON3_VH3R96-3P1_VH3.96-3P ZZ  [VH3R96-3P1]  54.97 15.83 0 top
U9  CON3_VH3R96-3P1_VH3.96-3P ZZ  [VH3R96-3P1]  70.68 15.83 0 top
U10  CON3_VH3R96-3P1_VH3.96-3P ZZ  [VH3R96-3P1]  86.4 15.83 0 top
U11  CON3_VH3R96-3P1_VH3.96-3P ZZ  [VH3R96-3P1]  117.83 15.83 0 top
U12  CON3_VH3R96-3P1_VH3.96-3P ZZ  [VH3R96-3P1]  102.11 15.83 0 top
U13  CON3_VH3R96-3P1_VH3.96-3P ZZ  [VH3R96-3P1]  180.69 15.83 0 top
U14  CON3_VH3R96-3P1_VH3.96-3P ZZ  [VH3R96-3P1]  196.41 15.83 0 top
U40  TPS54360BDDAR_SOIC8E_TPS54360BD  [SOIC8E]  179.93 34.25 270 top
U44  DBT50G-9.5-3P-BK-P OGC  [CONN-TH_3P-P9.50_DBT50G-9.5-3P]  24.55 67.98 180 top
U46  -  [QS8-S]  11.35 43.83 0 top
U47  DBT50G-9.5-2P-BK-P OGC  [CONN-TH_2P-P9.50_DBT50G-9.5-2P]  19.5 28.78 270 top
U49  2.54-16P ZZDK  [HDR-TH_16P-P2.50-V-F-1]  118.46 74.43 180 top
USB2  USB-226-BRY  [USB-A_TH_USB-256-BRWH150]  201.33 43.4 90 top

## Footprints (pads in the part's own frame, mm; a bottom-side part is the same pattern mirrored in y, then rotated)
C0603
  rect 0.8x0.9 smd: 1(-0.7,0) 2(0.7,0)
C0603#2
  rect 0.762x0.813 smd: 1(-0.762,0) 2(0.762,0)
C1210
  rect 1.6x2.7 smd: 1(-1.516,0) 2(1.516,0)
C_Ele_SMD_3x5.4mm
  rect 1.999x0.8 smd: 1(1.374,-0.014) 2(-1.364,-0.014)
CONN-TH_2P-P9.50_DBT50G-9.5-2P
  round 4 hole 2.1: 1(-4.75,0) 2(4.75,0)
CONN-TH_3P-P5.00_WJ500V-5.08-3P
  round 2 hole 1.3: 1(-5.08,0) 2(0,0) 3(5.08,0)
CONN-TH_3P-P9.50_DBT50G-9.5-3P
  oval 3.5x2.2 hole 2x1: 1(-9.5,0) 2(0,0) 3(9.5,0)
HDR-TH_16P-P2.50-V-F-1
  rect 1.4x1.4 hole 0.8: 1(-18.75,0)
  round 1.4 hole 0.8: 2(-16.25,0) 3(-13.75,0) 4(-11.25,0) 5(-8.75,0) 6(-6.25,0) 7(-3.75,0) 8(-1.25,0) 9(1.25,0) 10(3.75,0) 11(6.25,0) 12(8.75,0) 13(11.25,0) 14(13.75,0) 15(16.25,0) 16(18.75,0)
L0650
  rect 3x1.5 smd: 1(0,0) 2(0,-5.7)
QS8-S
  round 13.5 hole 11: 1(7.5,7.5) 2(22.5,7.5)
R0603
  rect 0.762x0.813 smd: 1(-0.762,0) 2(0.762,0)
R0603#2
  rect 0.806x0.864 smd: 1(-0.753,0) 2(0.753,0)
SMA
  rect 1.6x1.6 smd: 1(-1.95,0) 2(1.95,0)
SMB_L4.6-W3.6-LS5.3-BI
  rect 2.047x2.241 smd: 1(-2.591,0) 2(2.591,0)
SOD-123FL_L2.7-W1.8-LS3.8-RD
  rect 1.4x1.2 smd: 1(-1.735,0) 2(1.735,0)
SOIC8E
  oval 0.6x1.6 smd: 1(-1.905,-2.7) 2(-0.635,-2.7) 3(0.635,-2.7) 4(1.905,-2.7) 5(1.905,2.7) 6(0.635,2.7) 7(-0.635,2.7) 8(-1.905,2.7)
  rect 3.1x2.4 smd: 9(0,0)
SOT-23-3_L2.9-W1.3-P1.90-LS2.4-BR
  rect 1.25x0.7 smd: 1(1,-0.95) 2(1,0.95) 3(-1,0)
SW-SMD_MST22D18G2
  rect 1.2x2 smd: 1(-2.5,2.85) 2(0,2.85) 3(2.5,2.85) 4(-2.5,-2.85) 5(0,-2.85) 6(2.5,-2.85)
USB-A_TH_USB-256-BRWH150
  round 1.6 hole 1: 1(-3.5,1.2) 2(-1,1.2) 3(1,1.2) 4(3.5,1.2)
  oval 1.524x3 hole 0.8x2.3: 5(-6.35,-1.2) 6(6.35,-1.2)
VH3R96-3P1
  round 2.8 hole 1.8: 1(-3.96,0) 2(0,0) 3(3.96,0)
XH2R54-21
  round 1.7 hole 0.9: 1(0,0)
  round 1.8 hole 0.9: 2(2.5,0)
XH2R54-21#2
  round 1.8 hole 0.9: 1(0,0) 2(2.5,0)
XH2R54-21#3
  round 1.5 hole 0.9: 1(0,0) 2(2.5,0)

## Nets
GND: C1.2 C2.2 C3.2 C4.2 C5.1 C5#2.1 C6.2 C7.2 C10.1 C11.1 C53.2 C54.2 C56.2 C57.2 C58.1 C59.1 D1.1 D2.1 D3.1 D4.2 J1.1 J2.1 J3.2 J4.2 J5.2 J6.1 J7.1 J8.1 J9.1 J10.1 J11.1 J12.1 J13.1 J14.1 J15.2 J16.1 J17.1 P1.3 R2.1 R4.1 R4#2.1 R5.1 R6#2.1 R8.1 R9.1 R11.1 R12.1 R14.1 R15.1 R17.1 R18.1 R20.1 R21.1 R23.1 R24.1 R26.1 R27.1 R29.1 R30.1 R32.1 R33.1 R35#2.1 R36.1 R36#2.1 R38#2.1 R39.1 R39#2.1 R40.1 R41.1 U1.1 U1.2 U1.3 U2.7 U2.9 U3.2 U4.2 U5.2 U6.2 U7.2 U8.2 U9.2 U10.2 U11.2 U12.2 U13.2 U14.2 U40.7 U40.9 U46.2 U49.16 USB2.4 USB2.5 USB2.6
VCC_5V: C53.1 C54.1 L4.2 R35.2 USB2.1
VCC_24V: D3.2 D4.1 J3.1 J4.1 J5.1 J11.2 J15.1 P1.1 Q1.3 Q4.3 Q6.3 Q8.3 Q10.3 Q12.3 Q14.3 Q16.3 Q18.3 Q20.3 Q22.3 Q24.3 SW1.2 SW1.5 U49.1
VCC_24V_OUT: C1.1 C2.1 L1.2 R6.2 SW1.1
1: J14.2 Q23.3 Q24.2 U14.3 U49.4
1.1: J2.2 Q21.3 Q22.2 U13.3 U49.5
1.2: J8.2 Q5.3 Q6.2 U8.3 U49.13
1.4: J10.2 Q9.3 Q10.2 U10.3 U49.11
1.5: J9.2 Q7.3 Q8.2 U9.3 U49.12
1.6: J1.2 Q11.3 Q12.2 U12.3 U49.10
2.4: J17.2 Q19.3 Q20.2 U4.3 U49.6
2.8: J16.2 Q17.3 Q18.2 U3.3 U49.7
5.2: J12.2 Q13.3 Q14.2 U11.3 U49.9
5.8: J6.2 Q1.2 Q2.3 U6.3 U49.15
433: J13.2 Q15.3 Q16.2 U5.3 U49.8
900: J7.2 Q3.3 Q4.2 U7.3 U49.14
N7210: C8.1 U2.1
N7211: R1.1 R2.2 U2.3
N7212: R4.2 U2.4
N7213: C10.2 R3.1
N7214: C11.2 R3.2 U2.6
N7215: R5.2 R6.1 U2.5
SW0: P1.2 R7.2 U49.3
SW0_12V: Q1.1 Q4.1 Q6.1 Q8.1 Q10.1 Q12.1 Q14.1 Q16.1 Q18.1 Q20.1 Q22.1 Q24.1 R5#2.2 R7.1 R8.2 R10.2 R13.2 R16.2 R19.2 R22.2 R25.2 R28.2 R31.2 R34.2 R37#2.2 R40#2.2
V+: C3.1 C4.1 C5.2 C5#2.2 C6.1 C7.1 C56.1 C57.1 R1.2 R37.2 SW1.3 U2.2 U3.1 U4.1 U5.1 U6.1 U7.1 U8.1 U9.1 U10.1 U11.1 U12.1 U13.1 U14.1 U40.2 U47.1 U47.2
$2N560: Q2.2 R4#2.2
$2N659: Q2.1 R5#2.1 R6#2.2
$2N1166: Q3.1 R10.1 R11.2
$2N1170: Q3.2 R9.2
$2N1394: Q5.1 R13.1 R14.2
$2N1398: Q5.2 R12.2
$2N1622: Q7.1 R16.1 R17.2
$2N1626: Q7.2 R15.2
$2N1850: Q9.1 R19.1 R20.2
$2N2502: Q9.2 R18.2
$3N270: Q11.1 R22.1 R23.2
$3N274: Q11.2 R21.2
$3N498: Q13.1 R25.1 R26.2
$3N502: Q13.2 R24.2
$3N726: Q15.1 R28.1 R29.2
$3N730: Q15.2 R27.2
$3N954: Q17.1 R31.1 R32.2
$3N958: Q17.2 R30.2
$3N1182: Q19.1 R34.1 R35#2.2
$3N1186: Q19.2 R33.2
$3N1410: Q21.1 R37#2.1 R38#2.2
$3N1414: Q21.2 R36#2.2
$3N1641: Q23.1 R40#2.1 R41.2
$3N1645: Q23.2 R39#2.2
N41242: U44.1 U44.2 U44.3 U46.1
N62769: R37.1 R39.2 U40.3
N62809: R40.2 U40.4
N62825: C52.1 U40.1
N62837: C52.2 D1.2 L4.1 U40.8
N62839: C8.2 D2.2 L1.1 U2.8
N62937: C58.2 R38.2 U40.6
N62993: C59.2 R38.1
N63043: R35.1 R36.2 U40.5

Pads without a net: SW1 4 6; U49 2; USB2 2 3

## Via types
v1: diameter 0.762, hole 0.508, Top Layer to Bottom Layer, 279 vias
v2: diameter 4.6, hole 3.3, Top Layer to Bottom Layer, 4 vias

## Routing (per net, layer and track width the routed paths; a pad name or vN(x,y) marks a point on that pad's centre or on a via; arc(x,y) is an arc through that point)
GND: length 89.1
  Top Layer w0.3: v1(143.81,61.6) 153.18,61.6 v1(153.21,61.63) 153.21,56.6 v1(154.66,55.15) ; P1.3 U49.16
  Top Layer w0.5: C54.2 v1(192.24,41.97) ; 194.05,40.63 v1(194.05,41.97)
  Top Layer w0.6: v1(149.91,38.4) 149.93,38.42 C1.2 ; C2.2 v1(151.76,38.33)
  Bottom Layer w0.3: v1(179.13,59.6) 179.1,59.64 R12.1 179.1,63.56 R14.1 ; 143.05,52.87 143.03,52.85 R30.1 ; R17.1 170.68,62.89 R15.1 170.66,62.18 172.98,59.85 v1(172.98,57.1) ; R27.1 150.95,53.56 R29.1 153.06,53.58 154.63,55.15 v1(154.66,55.15) ; R36#2.1 116.47,44.83 R38#2.1 ; R35#2.1 134.92,52.51 R33.1 ; R20.1 161.62,65.21 R18.1 161.62,62.01 162.18,61.45 169.03,61.45 v1(170.68,59.8) ; v1(198.36,59.95) 198.38,59.97 R4#2.1 198.38,63.61 R6#2.1 ; v1(193.88,57.23) 193.88,59.28 192.01,61.15 189.9,61.15 R9.1 189.18,63.58 189.2,63.6 ; R39#2.1 105.88,41.64 R41.1 ; R23.1 153.25,65.16 R21.1 153.25,61.67 v1(153.21,61.63) ; R26.1 143.9,64.83 R24.1 143.9,61.69 v1(143.81,61.6)
  vias: v1(45.85,76.78) v1(45.85,73.78) v1(45.85,70.78) v1(48.85,76.78) v1(48.85,73.78) v1(48.85,70.78) v1(51.85,76.78) v1(51.85,73.78) v1(51.85,70.78) v1(55.95,77.07) v1(55.95,74.07) v1(55.95,71.07) v1(58.95,77.07) v1(58.95,74.07) v1(58.95,71.07) v1(61.95,77.07) v1(61.95,74.07) v1(61.95,71.07) v1(65.95,77) v1(65.95,74) v1(65.95,71) v1(68.95,77) v1(68.95,74) v1(68.95,71) v1(71.95,77) v1(71.95,74) v1(71.95,71) v1(75.63,76.6) v1(75.63,73.6) v1(75.63,70.6) v1(78.63,76.6) v1(78.63,73.6) v1(78.63,70.6) v1(81.63,76.6) v1(81.63,70.6) v1(85.9,76.6) v1(85.9,70.6) v1(88.9,76.6) v1(88.9,70.6) v1(91.9,76.6) v1(91.9,70.6) v1(122.03,43.25) v1(124.13,43.25) v1(126.52,43.25) v1(128.79,43.25) v1(130.96,43.25) v1(169.98,57.1) v1(169.98,54.1) v1(169.98,51.1) v1(172.98,54.1) v1(172.98,51.1) v1(175.98,57.1) v1(175.98,54.1) v1(175.98,51.1) v1(193.88,54.23) v1(193.88,51.23) v1(196.88,57.23) v1(196.88,54.23) v1(196.88,51.23) v1(199.88,57.23) v1(199.88,54.23) v1(199.88,51.23) v1(203.68,68.48) v1(203.68,65.48) v1(203.68,62.48) v1(204.48,32.15) v1(204.48,29.15) v1(206.68,68.48) v1(206.68,65.48) v1(206.68,62.48) v1(206.94,32.18) v1(206.99,29.13) v2(4,76) v2(4,4) v2(206,76) v2(206,4)
VCC_5V: length 22.4
  Top Layer w0.6: 190.38,39.06 190.38,32.46 188.87,30.95 185.46,30.95 185.36,30.85
  Top Layer w0.8: 190.58,39.23 194.05,39.23 ; 190.38,39.06 190.53,38.9
  Top Layer w1: C53.1 196.09,39.1 196.79,39.8 200.03,39.8 USB2.1
VCC_24V: length 156.2
  Top Layer w0.3: U49.1 137.23,74.45 137.23,76.55 135.48,78.3 85.83,78.3 81.95,74.43 P1.1
  Bottom Layer w0.3: 134.58,61.52 125.19,61.52 v1(125.13,61.58) ; 134.58,61.52 134.58,71.8 U49.1 ; 134.58,61.52 Q20.3 130.14,59.11 128.83,57.8 128.83,56.53 125.14,52.84 113.97,52.84 113.76,52.63 113.76,51.47 Q22.3 104.89,51.44 103.14,49.68 Q24.3 ; v1(160.16,72.33) 159.39,72.33 Q10.3 ; Q12.3 148.67,71.76 v1(146.71,69.8) 146.71,64.18 148.2,62.68 Q16.3 ; v1(142.51,71.63) 141.34,71.63 Q14.3 139.07,71.44 137.73,70.1 137.73,64.85 140.28,62.3 Q18.3
  vias: v1(183.98,61.88)
VCC_24V_OUT: length 1.1
  Top Layer w0.6: R6.2 143.87,34.26 v1(143.98,34.38)
  vias: v1(150.66,45.13) v1(150.68,43.4)
1: length 179.5
  Top Layer w0.8: J14.2 101.53,36.45 129.71,64.63 U49.4 129.71,74.61
  Bottom Layer w0.3: v1(103.53,38.5) 101.88,40.15 101.88,42.75 Q23.3 101.24,43.39 101.24,44.89 102.19,45.84 Q24.2
  Bottom Layer w0.8: J14.2 96.73,36.45 98.45,34.73 120.38,34.73 123.63,31.48 150.36,31.48 159.16,22.68 196.83,22.68 200.16,19.35 200.16,16.04 U14.3
1.1: length 172.9
  Top Layer w0.8: J2.2 95.37,44.03 105.76,44.03 127.21,65.48 U49.5 127.21,74.61
  Bottom Layer w0.3: Q21.3 111.82,46.59 111.82,48.09 112.77,49.04 Q22.2 111.19,49.44 v1(110.88,49.13)
  Bottom Layer w0.8: U13.3 184.73,15.91 184.73,17.98 181.53,21.18 158.46,21.18 149.58,30.05 123.01,30.05 119.95,33.11 91.05,33.11 90.48,33.68 90.48,40 92.18,41.7 94.68,41.7 95.2,42.23 J2.2
1.2: length 176.3
  Top Layer w0.3: v1(132.98,64.88) 133,64.86 v1(173.48,64.86)
  Top Layer w0.8: J8.2 66.23,41.73 66.23,55.65 73.13,62.55 102.78,62.55 107.21,66.98 U49.13 107.21,74.61
  Bottom Layer w0.3: v1(173.48,64.86) Q5.3 174.45,65.31 174.45,66.81 175.4,67.76 Q6.2 ; U49.13 107.05,74.28 107.05,66.88 108.86,65.08 132.78,65.08 v1(132.98,64.88)
  Bottom Layer w0.8: U8.3 58.9,15.85 58.9,21.13 60.95,23.18 J8.2
1.4: length 166.7
  Top Layer w0.3: v1(156.16,66.7) 131.66,66.7 v1(131.51,66.85)
  Top Layer w0.8: 112.21,74.61 U49.11 112.21,65.43 105.95,59.18 79.25,59.18 75.73,55.65 75.73,47.05 72.88,44.2 J10.2
  Bottom Layer w0.3: v1(131.51,66.85) 113.76,66.85 112.18,68.43 112.18,74.4 U49.11 ; Q10.2 157.93,69.41 156.98,68.46 156.98,66.96 Q9.3 156.35,66.51 v1(156.16,66.7)
  Bottom Layer w0.8: U10.3 90.23,15.95 90.23,18.7 88.88,20.05 76.83,20.05 66.12,30.76 66.12,36.14 72.7,42.73 J10.2
1.5: length 168.6
  Top Layer w0.3: v1(164.81,65.88) v1(132.33,65.88)
  Top Layer w0.8: 109.71,74.61 U49.12 109.71,65.28 105.28,60.85 76.05,60.85 72.95,57.76 J9.2
  Bottom Layer w0.3: Q8.2 166.96,68.78 166.01,67.83 166.01,66.33 Q7.3 v1(164.81,65.88) ; v1(132.33,65.88) 110.05,65.88 109.63,66.3 109.63,74.35 U49.12
  Bottom Layer w0.8: J9.2 72.95,50.58 63.6,41.23 63.6,29.93 74.64,18.89 U9.3
1.6: length 164.1
  Top Layer w0.3: v1(147.81,67.58) 131.93,67.58 v1(131.43,68.08)
  Top Layer w0.8: 114.71,74.61 U49.10 114.71,65.53 106.53,57.35 80.68,57.35 78.03,54.7 78.03,44.6 72.59,39.17 J1.2
  Bottom Layer w0.3: v1(147.81,67.58) 147.94,67.58 148.6,66.91 ; 148.6,66.91 Q11.3 ; 148.6,66.91 148.6,68.41 149.55,69.36 Q12.2 ; U49.10 114.71,68.4 115.03,68.08 v1(131.43,68.08)
  Bottom Layer w0.8: J1.2 72.59,27.51 78.35,21.75 103.01,21.75 106.07,18.68 U12.3
2.4: length 198.8
  Top Layer w0.3: v1(130.01,57.05) 125.41,57.05 v1(122.16,53.8)
  Top Layer w0.8: 124.71,74.61 U49.6 124.71,65.53 109.91,50.73 J17.2
  Bottom Layer w0.3: v1(130.01,57.05) 131.17,57.05 Q20.2 131.23,56.71 130.27,55.76 130.27,54.26 Q19.3 ; v1(122.16,53.8) 122.13,53.78 97.95,53.78 J17.2
  Bottom Layer w0.8: U4.3 168.94,18.22 167.41,19.75 157.73,19.75 149.11,28.38 122.11,28.38 118.91,31.58 90.2,31.58 88.73,33.05 88.73,46.73 89.9,47.9 93.25,47.9 94.9,49.55 J17.2
2.8: length 225.5
  Top Layer w0.3: v1(137.79,57.45) 133.36,57.45 132.41,58.4 v1(125.71,58.4)
  Top Layer w0.8: 122.21,74.61 U49.7 122.21,65.53 109.2,52.53 89.78,52.53 89.1,51.85 89.1,42.68 84.24,37.81 J16.2
  Bottom Layer w0.3: v1(125.71,58.4) 93.38,58.4 88.75,53.78 88.75,48.88 87.68,47.8 87.68,43.9 84.24,40.46 J16.2 ; Q17.3 138.38,54.6 138.38,56.1 139.33,57.05 ; Q18.2 v1(137.79,57.45)
  Bottom Layer w0.8: U3.3 153.36,15.96 153.36,21.23 148.11,26.48 121.36,26.48 118.56,29.28 84.88,29.28 84.24,29.92 J16.2
5.2: length 161.9
  Top Layer w0.3: v1(130.91,69.44) 130.94,69.4 v1(138.96,69.4)
  Top Layer w0.8: J12.2 84.15,54 85.85,55.7 107.66,55.7 117.21,65.25 U49.9 117.21,74.61
  Bottom Layer w0.3: v1(130.91,69.44) 117.55,69.44 117.18,69.8 117.18,70.1 117.21,70.13 U49.9 ; v1(138.96,69.4) 138.99,69.44 Q14.2 140.2,69.04 139.25,68.09 139.25,66.59 Q13.3
  Bottom Layer w0.8: U11.3 121.91,15.94 121.91,19.2 117.11,24 81.45,24 77.49,27.97 77.49,47.19 78.05,47.75 82.93,47.75 84.15,48.98 J12.2
5.8: length 216.1
  Top Layer w0.3: v1(193.13,62.98) 131.38,62.98 v1(131.28,62.88)
  Top Layer w0.8: J6.2 61.5,56.6 70.8,65.9 99.2,65.9 102.21,68.91 U49.15 102.21,74.61
  Bottom Layer w0.3: v1(193.13,62.98) 193.17,62.98 193.17,64.91 Q2.3 193.73,65.36 193.73,66.86 194.68,67.81 ; U49.15 101.51,73.73 101.51,69.18 107.8,62.88 v1(131.28,62.88)
  Bottom Layer w0.8: J6.2 61.5,50.8 41.55,30.85 41.55,26.55 36,21 30.13,21 27.49,18.37 U6.3
433: length 220.5
  Top Layer w0.3: v1(145.03,58.38) 143.1,60.31 143.1,60.33 142.88,60.55 v1(129.13,60.55)
  Top Layer w0.8: J13.2 86.9,47.15 86.9,52.8 88.33,54.23 108.58,54.23 119.71,65.35 U49.8 119.71,74.61
  Bottom Layer w0.3: v1(145.03,58.38) 147.04,58.38 Q16.2 147.25,57.76 146.3,56.81 146.3,55.31 Q15.3 ; v1(129.13,60.55) 92.7,60.55 86.7,54.55 86.7,46.95 J13.2
  Bottom Layer w0.8: U5.3 137.61,15.93 137.61,22.68 135.53,24.75 119.28,24.75 117.51,26.53 82.9,26.53 79.68,29.75 79.68,38.65 83.95,42.93 J13.2
900: length 195.9
  Top Layer w0.3: v1(183.76,63.85) 132.36,63.85 v1(132.13,64.08)
  Top Layer w0.8: 104.71,74.61 U49.14 104.71,66.83 102.05,64.18 71.38,64.18 64.25,57.05 64.25,48.88 61.45,46.08 J7.2
  Bottom Layer w0.3: v1(183.76,63.85) 183.94,63.85 Q3.3 184.53,65.34 184.53,66.84 185.48,67.79 Q4.2 ; U49.14 104.58,74.3 104.58,67.6 107.52,64.67 107.54,64.67 108.13,64.08 v1(132.13,64.08)
  Bottom Layer w0.8: U7.3 42.6,16.43 42.6,24.33 61.45,43.18 J7.2
N7210: length 1.7
  Top Layer w0.6: C8.1 133.16,39.37 U2.1
N7211: length 3.6
  Top Layer w0.6: U2.3 133.55,36.83 R2.2 R1.1
N7212: length 1.3
  Top Layer w0.6: U2.4 134.94,35.48 R4.2
N7213: length 1.6
  Top Layer w0.6: R3.1 C10.2
N7214: length 3.9
  Top Layer w0.6: C11.2 143.78,36.27 R3.2 141.72,36.83 U2.6
N7215: length 3.1
  Top Layer w0.6: R6.1 R5.2 140.27,34.71 U2.5
SW0: length 66.2
  Bottom Layer w0.3: P1.2 86.75,77 87.9,78.15 130.78,78.15 132.21,76.73 U49.3 133.73,75.95 143.9,75.95 R7.2
SW0_12V: length 213.7
  Bottom Layer w0.3: Q16.1 149.25,58.26 R28.2 154.93,62.2 154.93,68.23 R22.2 151.55,69.87 151.54,69.85 ; 145.77,73.1 138.36,73.1 135.76,70.5 135.76,59.74 133.23,57.21 ; 145.77,73.1 146.01,73.1 R7.1 149.04,74.23 R8.2 149.95,74.45 151.54,74.45 ; 145.77,73.1 Q14.1 ; 151.54,74.45 161.63,74.45 ; 151.54,74.45 151.54,69.85 ; Q4.1 187.48,68.29 189.23,68.29 189.23,74.31 189.08,74.45 ; Q10.1 159.93,69.92 R19.2 161.68,74.41 161.63,74.45 ; 171.84,74.45 171.84,70.41 R16.2 168.96,69.28 Q8.1 ; 171.84,74.45 179.06,74.45 ; 171.84,74.45 161.63,74.45 ; 133.23,57.21 Q20.1 ; 133.23,57.21 R34.2 136.51,55.68 136.51,49.78 136.27,49.54 117.84,49.54 ; Q24.1 104.19,46.35 R40#2.2 109.21,46.35 113.63,41.93 117.56,41.93 117.84,42.21 117.84,49.54 ; 196.68,68.32 196.98,68.62 196.98,71.05 193.58,74.45 189.08,74.45 ; 196.68,68.32 Q1.1 ; 196.68,68.32 R5#2.2 ; 179.06,74.45 179.15,74.37 R13.2 177.41,68.27 Q6.1 ; 179.06,74.45 189.08,74.45 ; 151.54,69.85 151.45,69.76 ; Q22.1 114.78,49.54 R37#2.2 117.84,49.54 ; Q18.1 141.33,57.56 143.08,57.56 143.08,59.55 145.53,62 145.53,67.96 R25.2 142.2,69.54
V+:
  vias: v1(5.7,39.25) v1(5.7,36.25) v1(5.7,33.25) v1(5.9,28.75) v1(5.9,25.75) v1(5.9,22.75) v1(7.25,17.05) v1(7.25,14.05) v1(7.25,11.05) v1(8.7,39.25) v1(8.7,36.25) v1(8.7,33.25) v1(8.9,28.75) v1(8.9,25.75) v1(8.9,22.75) v1(10.25,17.05) v1(10.25,14.05) v1(10.25,11.05) v1(11.7,39.25) v1(11.7,36.25) v1(11.7,33.25) v1(11.9,28.75) v1(11.9,25.75) v1(11.9,22.75) v1(13.25,17.05) v1(13.25,14.05) v1(13.25,11.05) v1(16.68,8.9) v1(16.68,5.9) v1(16.68,2.9) v1(19.68,8.9) v1(19.68,5.9) v1(19.68,2.9) v1(22.68,8.9) v1(22.68,5.9) v1(22.68,2.9) v1(32.38,8.63) v1(32.38,5.63) v1(32.38,2.63) v1(35.38,8.63) v1(35.38,5.63) v1(35.38,2.63) v1(38.38,8.63) v1(38.38,5.63) v1(38.38,2.63) v1(47.85,8.8) v1(47.85,5.8) v1(47.85,2.8) v1(50.85,8.8) v1(50.85,5.8) v1(50.85,2.8) v1(53.85,8.8) v1(53.85,5.8) v1(53.85,2.8) v1(62.73,8.58) v1(62.73,5.58) v1(62.73,2.58) v1(65.73,8.58) v1(65.73,5.58) v1(65.73,2.58) v1(68.73,8.58) v1(68.73,5.58) v1(68.73,2.58) v1(78.88,8.63) v1(78.88,5.63) v1(78.88,2.63) v1(81.88,8.63) v1(81.88,5.63) v1(81.88,2.63) v1(84.88,8.63) v1(84.88,5.63) v1(84.88,2.63) v1(94.53,8.5) v1(94.53,5.5) v1(94.53,2.5) v1(97.53,8.5) v1(97.53,5.5) v1(97.53,2.5) v1(100.53,8.5) v1(100.53,5.5) v1(100.53,2.5) v1(110.51,8.58) v1(110.51,5.58) v1(110.51,2.58) v1(113.51,8.58) v1(113.51,5.58) v1(113.51,2.58) v1(116.51,8.58) v1(116.51,5.58) v1(116.51,2.58) v1(126.41,8.7) v1(126.41,5.7) v1(126.41,2.7) v1(129.41,8.7) v1(129.41,5.7) v1(129.41,2.7) v1(132.41,8.7) v1(132.41,5.7) v1(132.41,2.7) v1(141.81,8.8) v1(141.81,5.8) v1(141.81,2.8) v1(144.81,8.8) v1(144.81,5.8) v1(144.81,2.8) v1(147.81,8.8) v1(147.81,5.8) v1(147.81,2.8) v1(157.91,8.93) v1(157.91,5.93) v1(157.91,2.93) v1(160.91,8.93) v1(160.91,5.93) v1(160.91,2.93) v1(163.91,8.93) v1(163.91,5.93) v1(163.91,2.93) v1(173.56,8.7) v1(173.56,5.7) v1(173.56,2.7) v1(176.56,8.7) v1(176.56,5.7) v1(176.56,2.7) v1(179.56,8.7) v1(179.56,5.7) v1(179.56,2.7) v1(188.56,8.63) v1(188.56,5.63) v1(188.56,2.63) v1(191.56,8.63) v1(191.56,5.63) v1(191.56,2.63) v1(194.56,8.63) v1(194.56,5.63) v1(194.56,2.63)
$2N560: length 2.3
  Bottom Layer w0.3: Q2.2 196.18,63.82 196.87,63.13 R4#2.2
$2N659: length 4.2
  Bottom Layer w0.3: Q2.1 196.91,65.13 R6#2.2 198.43,65.17 R5#2.1
$2N1166: length 4.2
  Bottom Layer w0.3: R10.1 189.23,65.14 R11.2 187.71,65.11 Q3.1
$2N1170: length 2.3
  Bottom Layer w0.3: R9.2 187.67,63.11 186.98,63.8 Q3.2
$2N1394: length 4.2
  Bottom Layer w0.3: Q5.1 177.63,65.08 R14.2 179.15,65.12 R13.1
$2N1398: length 2.3
  Bottom Layer w0.3: R12.2 177.59,63.08 176.9,63.77 Q5.2
$2N1622: length 4.2
  Bottom Layer w0.3: 168.46,66.83 169.19,66.1 R17.2 170.71,66.13 R16.1
$2N1626: length 2.3
  Bottom Layer w0.3: R15.2 169.15,64.1 168.46,64.79 Q7.2
$2N1850: length 4.2
  Bottom Layer w0.3: R19.1 161.68,66.77 161.64,66.73 160.15,66.73 Q9.1
$2N2502: length 2.3
  Bottom Layer w0.3: R18.2 160.12,64.73 159.43,65.42 Q9.2
$3N270: length 4.2
  Bottom Layer w0.3: Q11.1 151.78,66.68 R23.2 153.3,66.72 R22.1
$3N274: length 2.3
  Bottom Layer w0.3: 151.05,65.51 151.05,65.37 151.74,64.68 151.74,63.46
$3N498: length 4.2
  Bottom Layer w0.3: Q13.1 142.43,66.36 R26.2 143.95,66.39 R25.1
$3N502: length 2.3
  Bottom Layer w0.3: Q13.2 141.7,65.05 142.39,64.36 R24.2
$3N726: length 4.2
  Bottom Layer w0.3: R28.1 151,55.12 R29.2 149.48,55.08 Q15.1
$3N730: length 2.3
  Bottom Layer w0.3: Q15.2 148.75,53.77 149.44,53.08 149.44,51.86
$3N954: length 4.2
  Bottom Layer w0.3: Q17.1 141.56,54.37 R32.2 143.08,54.41 R31.1
$3N958: length 2.3
  Bottom Layer w0.3: Q17.2 140.83,53.06 141.52,52.37 R30.2
$3N1182: length 4.2
  Bottom Layer w0.3: Q19.1 133.45,54.03 R35#2.2 134.98,54.07 134.98,55.71
$3N1186: length 2.3
  Bottom Layer w0.3: Q19.2 132.73,52.72 133.42,52.03 R33.2
$3N1410: length 4.2
  Bottom Layer w0.3: R37#2.1 116.52,46.39 116.49,46.36 115,46.36 Q21.1
$3N1414: length 2.3
  Bottom Layer w0.3: R36#2.2 114.96,44.36 114.27,45.05 Q21.2
$3N1641: length 4.2
  Bottom Layer w0.3: Q23.1 104.41,43.16 105.91,43.16 105.94,43.2 R40#2.1
$3N1645: length 2.3
  Bottom Layer w0.3: Q23.2 103.69,41.85 104.38,41.16 104.38,39.94
N41242:
  vias: v1(4.8,62.63) v1(4.8,59.63) v1(4.83,54.1) v1(4.83,51.1) v1(4.83,48.1) v1(7.8,62.63) v1(7.8,59.63) v1(7.83,54.1) v1(7.83,51.1) v1(7.83,48.1) v1(10.8,62.63) v1(10.8,59.63) v1(14.15,62.55) v1(14.15,59.55) v1(17.15,62.55) v1(17.15,59.55) v1(20.15,62.55) v1(20.15,59.55) v1(23.18,64.6) v1(23.18,61.6) v1(26.18,64.6) v1(26.18,61.6) v1(29.18,64.6) v1(29.18,61.6) v1(32.25,64.58) v1(32.25,61.58) v1(35.25,64.58) v1(35.25,61.58) v1(38.25,64.58) v1(38.25,61.58)
N62769: length 3.6
  Top Layer w0.6: 175.99,33.42 175.71,33.42 R39.2 R37.1 ; 177.04,33.42 U40.3
  Top Layer w0.8: 175.99,33.42 177.04,33.42
N62809: length 1.3
  Top Layer w0.8: 177.36,32.15 177.36,30.88 177.39,30.85
N62825: length 1.7
  Top Layer w0.6: U40.1 177.21,36.18 C52.1
N62837: length 14.7
  Top Layer w0.8: 175.58,37.51 175.58,37.86 176.15,38.43 177.62,38.43
  Top Layer w1: 184.6,39.25 184.6,40.19 182.5,42.29 178.31,42.29 177.65,41.63 177.65,40.69 177.68,40.66 D1.2
N62839: length 14.6
  Top Layer w1: 142.23,42.47 142.23,43.4 140.13,45.5 135.94,45.5 135.28,44.84 135.28,43.9 135.31,43.88 D2.2 134.42,40.92 C8.2
N62937: length 3.9
  Top Layer w0.6: U40.6 184.09,33.62 R38.2 186.15,33.06 C58.2 ; 184.73,32.86 184.7,32.88 184.65,32.88
N62993: length 1.7
  Top Layer w0.6: R38.1 C59.2 ; 186.22,34.38 186.3,34.38
N63043: length 3.1
  Top Layer w0.6: 182.76,32.15 182.76,31.35 182.26,30.85 183.84,30.85

## Copper pours and planes (outline as drawn; the poured copper is in the pictures)
GND on Top Layer: 179.63,39.99 179.63,39.29 179.22,38.89 179.22,37.49 178.92,37.19 178.92,36.8 178.58,36.45 178.58,32.49 178.82,32.24 181.15,32.24 181.45,32.54 181.45,34.07 181.6,34.22 183.45,34.22 183.57,34.34 183.57,35.22 183.35,35.44 181.83,35.44 181.53,35.74 181.53,36.78 181.82,37.07 182.7,37.07 183.17,37.54 183.17,39.87 182.62,40.42 182.62,40.44 180.07,40.44
GND on Top Layer: 165.28,35.68 166.04,34.92 167.43,34.92 169.38,36.88 169.38,37.73 168.51,38.6 165.36,38.6 165.16,38.4 165.28,38.28
GND on Top Layer: outline of 273 points within -0.05,-0.08 210,80
GND on Top Layer: 187.32,31.66 187.32,34.99 189.8,34.99 189.8,32.87 188.58,31.66
GND on Top Layer: 131.83,35.13 132.12,35.41 133.5,35.41 133.88,35.03 133.88,33.48 134.03,33.33 136.01,33.33 136.26,33.08 136.26,30.88 136.06,30.68 133.78,30.68 131.83,32.63
GND on Top Layer: 137.26,43.2 137.26,42.51 136.86,42.1 136.86,40.7 136.56,40.41 136.56,40.01 136.21,39.66 136.21,35.7 136.46,35.45 138.78,35.45 139.08,35.75 139.08,37.28 139.23,37.43 141.08,37.43 141.21,37.55 141.21,38.43 140.98,38.65 139.47,38.65 139.17,38.95 139.17,39.99 139.46,40.28 140.33,40.28 140.81,40.75 140.81,43.08 140.26,43.63 140.26,43.65 137.71,43.65
GND on Top Layer: 120.23,39.66 120.66,39.23 120.66,39.2 122.63,39.2 122.68,39.25 123.91,38.03 125.06,38.03 125.88,38.85 130.76,38.85 132.01,40.1 132.01,44.58 131.06,45.53 122.46,45.53 120.26,43.33 120.26,39.69
GND on Top Layer: 136.23,35.29 135.7,34.76 135.7,32.33 136.03,32 138.81,32 138.91,32.1 138.91,37.05 139.06,37.2 136.46,37.2 136.21,36.95 136.23,36.93
GND on Top Layer: 144.95,34.87 144.95,38.2 147.43,38.2 147.43,36.08 146.21,34.87
GND on Top Layer: 41.03,21.98 40.53,21.48 40.53,20.28 42.05,21.8 42.2,21.8 41.73,22.28 41.45,22.28 41.15,21.98
GND on Bottom Layer: 97.65,41.58 97.65,37.85 99.23,36.28 119.23,36.28 120.23,37.28 120.23,38.75 120.78,39.3 120.78,40.35 119.56,41.58
GND on Bottom Layer: 22.3,17.65 28.65,24 28.65,19.23 22.88,13.45 22.45,13.88 22.45,13.98 22.3,14.13 22.3,17.55 22.2,17.65
GND on Bottom Layer: 33.7,43.08 35.25,41.53 35.55,41.53 36.7,40.38 36.75,40.38 36.75,24.78 35.28,23.3 31.48,23.3 25.25,17.08 25.25,14.33 24.48,13.55 22.85,13.55 22.28,14.13 22.28,17.7 28.65,24.08 28.65,34.9 29.23,35.48 29.23,38.6
GND on Bottom Layer: 36.7,42.44 36.7,40.1 36.63,40.03 35.2,40.03 35.2,42.05 35.15,42.1 35.49,42.44
GND on Bottom Layer: 200.68,38.22 201.96,39.5 201.96,46.11 201.32,46.74 201.32,59.54 200.43,60.43 200.43,74.7 198.81,76.33 173.98,76.33 173.13,75.48 134.66,75.48 133.36,76.78 102.3,76.78 100.93,75.4 100.93,74.13 99.01,72.21 97.46,72.21 92.96,67.7 70.73,67.7 69.15,66.13 60.88,66.13 28.65,33.9 28.65,54.85 31.58,57.78 40.6,57.78 42.93,60.1 42.93,72.05 40.4,74.58 6.28,74.58 6.25,74.6 2.37,70.72 2.37,7.88 2.78,7.48 5.43,7.48 7.12,5.78 7.12,1.25 6.03,0.15 1.05,0.15 0.39,0.82 0.39,78.64 1.45,79.7 160.61,79.7 160.78,79.88 206.26,79.88 209.29,76.85 209.29,1.2 208.29,0.2 204.63,0.2 203.38,1.45 203.38,18.45 203.43,18.5 200.68,21.26
GND on Bottom Layer: 149.51,40.64 152.82,40.64 154.76,42.58 154.76,46.7 153.83,47.63 153.83,47.7 132.98,47.7 131.88,46.6 131.88,40.13 130.76,39 125.91,39 124.98,38.08 123.91,38.08 122.72,39.26 120.67,39.26 120.33,39.6 99.23,39.6 97.63,41.2 97.63,54.5 98.5,55.38 123.93,55.38 124.19,55.64 125.37,55.64 125.41,55.68 151.36,55.68 155.53,51.5 166.11,51.5 166.11,57.87 168.62,60.38 187.95,60.38 188.11,60.54 200.51,60.54 202.93,58.12 202.93,46.34 202.43,45.84 198.68,45.84 198.68,45.77 198.46,45.54 198.46,42.91 195.58,40.04 192.18,40.04 192.18,40.24 190.88,41.54 188.78,41.54 187.71,42.61 187.71,43.94 187.11,43.94 186.98,43.81 177.93,43.81 174.7,40.58 174.7,37.67 172.79,35.75 171.29,35.75 170.93,36.11 168.41,36.11 167.84,36.68 166.09,36.68 165.48,36.06 161.38,36.06 155.98,30.66 136.13,30.66 135.78,31.01 135.83,31.06 135.83,33.29 135.98,33.44 143.96,33.44 144.83,34.31 144.83,39.31 145.68,40.16 149.03,40.16
VCC_24V on Top Layer: 131.88,76.43 131.03,75.58 131.03,68.05 137.83,61.25 158.41,61.25 158.98,60.68 158.98,52.75 159.66,52.08 160.53,52.08 161.36,52.9 161.36,60.68 161.91,61.23 197.56,61.23 199.71,63.38 199.71,74.35 198.43,75.63 174.52,75.63 174.03,75.14 134.02,75.14 132.73,76.43
VCC_24V on Top Layer: 145.03,42.48 145.03,40.9 145.31,40.63 146.23,40.63 146.26,40.65 147.16,40.65 147.16,41.92 146.6,42.48
VCC_24V on Bottom Layer: 186.81,24.45 199.43,24.45 199.88,24.9 199.88,34.23 198.86,35.25 192.53,35.25 190.71,37.08 190.71,67.83 190.78,67.9 180.91,67.9 180.76,68.05 180.76,27.9 184.33,24.33 186.68,24.33
VCC_24V on Bottom Layer: 61.91,65.43 64.93,65.43 65,65.5 69.65,65.5 71.35,67.2 93.35,67.2 97.43,71.28 128.88,71.28 131.31,73.7 131.31,75.65 131.88,76.23 132.78,76.23 134.16,74.85 174.13,74.85 174.61,75.33 174.66,75.28 198.11,75.28 199.28,74.1 199.28,63.8 197.66,62.18 128.28,62.18 122.46,56.35 89.35,56.35 89.15,56.15 60.26,56.15 56.89,52.78 56.89,48.81 40.23,32.15 40.23,26.49 39.75,26 37.66,26 37.37,26.29 37.37,39.69 37.28,39.78 37.28,40.79 61.91,65.42
VCC_24V_OUT on Top Layer: 145.66,41.03 145.66,40.58 148.58,40.58 148.88,40.88 156.03,40.88 165.08,49.93 165.08,53.73 163.58,55.23 162.26,55.23 161.56,54.53 161.56,52.2 155.51,46.15 145.78,46.15 145.28,45.65 145.01,45.65 145.01,41.68
VCC_24V_OUT on Bottom Layer: 142.28,34.97 142.28,33.85 142.38,33.75 143.9,33.75 144.41,34.26 144.41,39.42 147.51,42.53 151.01,42.53 151.68,43.2 151.68,45.5 151.28,45.9 144.96,45.9 144.31,45.25 144.31,40.73 143.66,40.08 143.66,35.41 143.22,34.97
V+ on Top Layer: outline of 175 points within 2.62,0.62 202.86,55.95
V+ on Top Layer: 131.44,38.37 135.46,38.37 135.73,38.1 135.73,37.6 135.66,37.53 132.03,37.53 131.82,37.31 131.65,37.31 131.39,37.57 131.39,38.33
V+ on Bottom Layer: outline of 107 points within 2.55,0.75 202.78,42.75
N41242 on Top Layer: 2.8,45.73 5,43.53 22.15,43.53 25.38,46.75 25.38,57.78 27.5,59.9 39.15,59.9 41,61.75 41,71.45 39.98,72.48 7.58,72.48 2.68,67.58 2.8,67.45
N41242 on Bottom Layer: 2.74,45.88 4.94,43.68 22.09,43.68 25.31,46.9 25.31,57.93 27.44,60.05 39.09,60.05 40.94,61.9 40.94,71.6 39.91,72.63 7.51,72.63 2.61,67.73 2.74,67.6
N62837 on Top Layer: 182.03,35.85 183.86,35.85 185.46,37.45 185.46,40.78 185.28,40.96 183.91,40.96 183.63,40.68 183.63,37.45 182.67,36.49 181.86,36.49 181.86,36.03
N62839 on Top Layer: 139.67,39.06 141.5,39.06 143.1,40.66 143.1,43.99 142.92,44.17 141.55,44.17 141.27,43.89 141.27,40.66 140.3,39.7 139.49,39.7 139.49,39.24
N63043 on Top Layer: 181.98,32.75 183.33,32.75 184.52,31.56 184.52,30.67 184.19,30.34 181.75,30.34 181.42,30.67 181.42,32.19

Small or netless copper shapes (teardrops, artwork), in the pictures only: 2 on Top Layer

## Text on the board
Top Silkscreen Layer: 24V | SW0 | GND | 2 | 7 | 6 | 4 | 9 | 3 | 12 | 10 | 11 | 8 | 5 | 1 | Chaarger | IN BAT | FAN | POWER | FAN4 | FAN3 | EXT BAT
